# Altium project DDR4-UDIMM — 16 GB DDR4.PrjPcb (part 1 of 2)
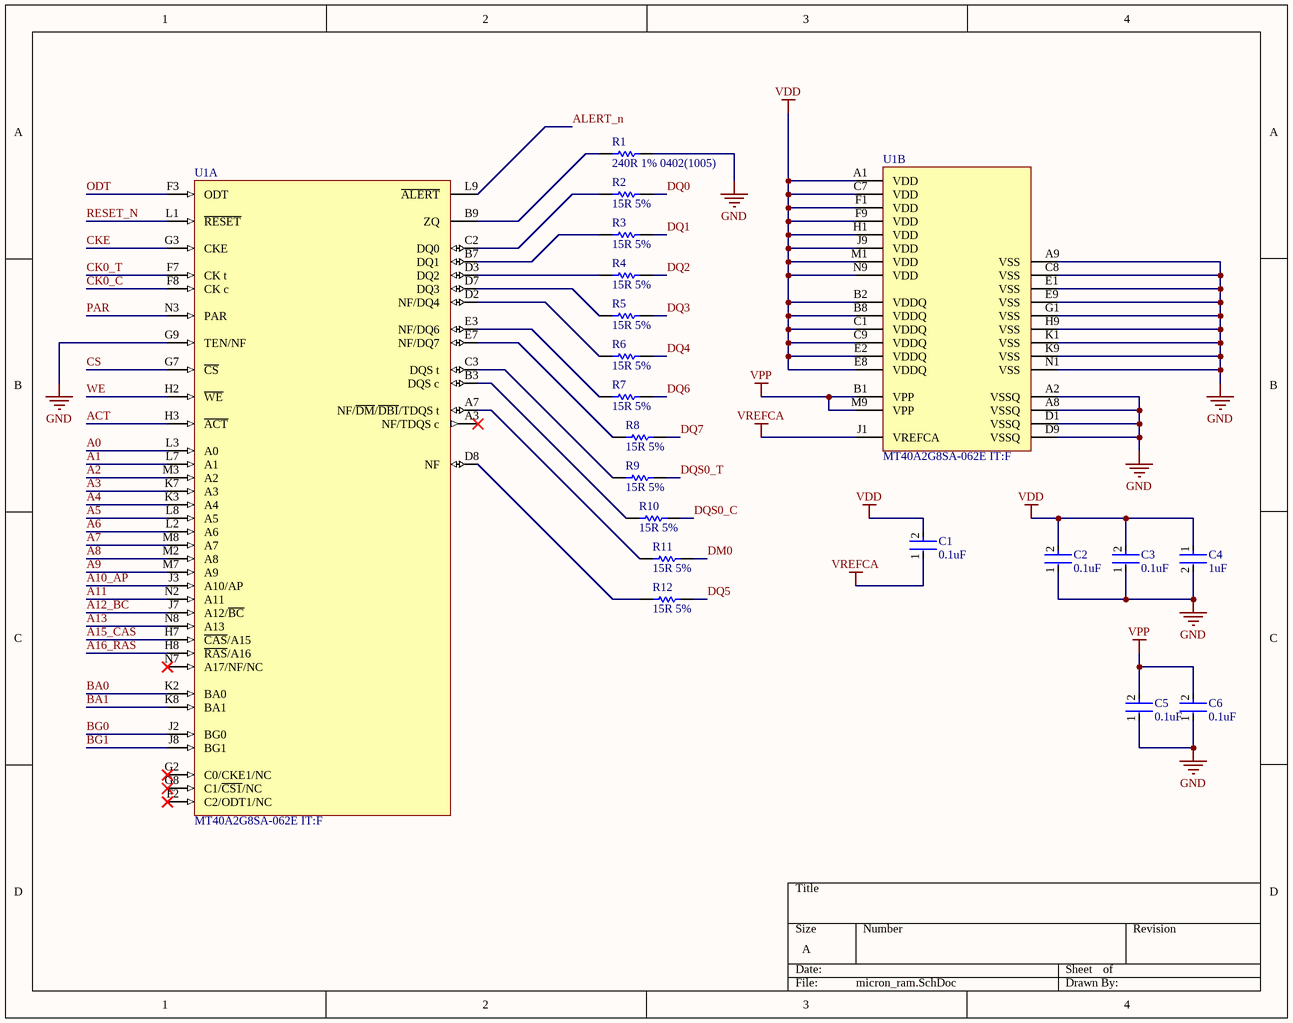
[diagram p0: micron_ram.SchDoc]
11 sheets, 206 parts. Net scope: global (net labels, ports and power ports of the same name join across sheets).
Board file: DDR4-UDIMM — 16 GB DDR4.PcbDoc
Sheets:
  micron_ram.SchDoc
  micron_P2.SchDoc
  micron_P3.SchDoc
  micron_P4.SchDoc
  micron_P5.SchDoc
  micron_P6.SchDoc
  micron_P7.SchDoc
  micron_P8.SchDoc
  edge.SchDoc
  SPD.SchDoc
  TERM.SchDoc

## Sheet micron_ram.SchDoc
size A; SheetNumber: 1; SheetTotal: 11

### Parts
C1  0.1uF  [FP-GRM15-MFG]
C2  0.1uF  [FP-GRM15-MFG]
C3  0.1uF  [FP-GRM15-MFG]
C4  1uF  [FP-CL511-IPC_C]
C5  0.1uF  [FP-GRM15-MFG]
C6  0.1uF  [FP-GRM15-MFG]
R1  240R 1% 0402(1005)  [RESC0402(1005)_L]
R2  15R 5%  [RESC1005X40X25LL05T10]
R3  15R 5%  [RESC1005X40X25LL05T10]
R4  15R 5%  [RESC1005X40X25LL05T10]
R5  15R 5%  [RESC1005X40X25LL05T10]
R6  15R 5%  [RESC1005X40X25LL05T10]
R7  15R 5%  [RESC1005X40X25LL05T10]
R8  15R 5%  [RESC1005X40X25LL05T10]
R9  15R 5%  [RESC1005X40X25LL05T10]
R10  15R 5%  [RESC1005X40X25LL05T10]
R11  15R 5%  [RESC1005X40X25LL05T10]
R12  15R 5%  [RESC1005X40X25LL05T10]
U1  MT40A2G8SA-062E IT:F  [SA_MFG]  (parts A,B of 2)

### Nets
GND: C2.1 C3.1 C4.2 C5.1 C6.1 R1.2 U1.A2(VSSQ) U1.A8(VSSQ) U1.A9(VSS) U1.C8(VSS) U1.D1(VSSQ) U1.D9(VSSQ) U1.E1(VSS) U1.E9(VSS) U1.G1(VSS) U1.G9(TEN/NF) U1.H9(VSS) U1.K1(VSS) U1.K9(VSS) U1.N1(VSS)
VDD: C1.2 C2.2 C3.2 C4.1 U1.A1(VDD) U1.B2(VDDQ) U1.B8(VDDQ) U1.C1(VDDQ) U1.C7(VDD) U1.C9(VDDQ) U1.E2(VDDQ) U1.E8(VDDQ) U1.F1(VDD) U1.F9(VDD) U1.H1(VDD) U1.J9(VDD) U1.M1(VDD) U1.N9(VDD)
VPP: C5.2 C6.2 U1.B1(VPP) U1.M9(VPP)
VREFCA: C1.1 U1.J1(VREFCA)
A0: U1.L3(A0)
A1: U1.L7(A1)
A2: U1.M3(A2)
A3: U1.K7(A3)
A4: U1.K3(A4)
A5: U1.L8(A5)
A6: U1.L2(A6)
A7: U1.M8(A7)
A8: U1.M2(A8)
A9: U1.M7(A9)
A10_AP: U1.J3(A10/AP)
A11: U1.N2(A11)
A12_BC: U1.J7(A12/~{BC})
A13: U1.N8(A13)
A15_CAS: U1.H7(~{CAS}/A15)
A16_RAS: U1.H8(~{RAS}/A16)
ACT: U1.H3(~{ACT})
ALERT_n: U1.L9(~{ALERT})
BA0: U1.K2(BA0)
BA1: U1.K8(BA1)
BG0: U1.J2(BG0)
BG1: U1.J8(BG1)
CK0_C: U1.F8(CK_c)
CK0_T: U1.F7(CK_t)
CKE: U1.G3(CKE)
CS: U1.G7(~{CS})
DM0: R11.2
DQ0: R2.2
DQ1: R3.2
DQ2: R4.2
DQ3: R5.2
DQ4: R6.2
DQ5: R12.2
DQ6: R7.2
DQ7: R8.2
DQS0_C: R10.2
DQS0_T: R9.2
ODT: U1.F3(ODT)
PAR: U1.N3(PAR)
RESET_N: U1.L1(~{RESET})
WE: U1.H2(~{WE})
NetR1_1: R1.1 U1.B9(ZQ)
NetR2_1: R2.1 U1.C2(DQ0)
NetR3_1: R3.1 U1.B7(DQ1)
NetR4_1: R4.1 U1.D3(DQ2)
NetR5_1: R5.1 U1.D7(DQ3)
NetR6_1: R6.1 U1.D2(NF/DQ4)
NetR7_1: R7.1 U1.E3(NF/DQ6)
NetR8_1: R8.1 U1.E7(NF/DQ7)
NetR9_1: R9.1 U1.C3(DQS_t)
NetR10_1: R10.1 U1.B3(DQS_c)
NetR11_1: R11.1 U1.A7(NF/~{DM}/~{DBI}/TDQS_t)
NetR12_1: R12.1 U1.D8(NF)

Not connected (* = marked no-connect by the designer): U1 A3(NF/TDQS_c)* F2(C2/ODT1/NC)* G2(C0/CKE1/NC)* G8(C1/~{CS1}/NC)* N7(A17/NF/NC)*

### Library data of the parts
C1-C3 C5 C6 = CMP-2100-03641-2: CAP CER 0.1UF 16V X7R 0402; Manufacturer Part Number: GRM155R71C104KA88D; Manufacturer: Murata; Standoff Height: 0mm; Tolerance: 10%; Voltage Rating: 16Vdc; Material: Ceramic; Capacitance: 0.10μF; Value: 0.10μF; RoHS: TRUE; Temperature Characteristic: X7R; Octopart: https://octopart.com/grm155r71c104ka88d-murata-196880; Digikey Description: CAP CER 0.1UF 16V X7R 0402; Device Class L3: Ceramic Capacitors; Height: 0.55mm; ComponentLink2Description: Datasheet; Temperature Range Low: -55°C; Ipc Land Pattern Name: CAPC10050X219; ComponentLink2URL: https://search.murata.co.jp/Ceramy/image/img/A01X/G101/ENG/GRM155R71H471KA01-01A.pdf; Device Class L1: Passive Components; Lead Free: yes; Category: Cap; Package: GRM15; Temperature: -55°C to +125°C; Device Class L2: Capacitors; Temperature Range High: +125°C; Mouser Description: 0402 0.1 uF 16V ±10 % Tolerance X7R SMT Multilayer Ceramic Capacitor
C4 = CMP-13271-001936-1: Cap Ceramic 1uF 10V X5R ±10% SMD 0402 +85°C Paper T/R; Depth: 0.5mm; Case Code (Imperial): 0402; Material: Ceramic; Mount: Surface Mount; Thickness: 0.022inch; Dielectric: X5R; Capacitance: 1uF; Radiation Hardening: No; Case/Package: 0402; Length: 1mm; Tolerance: 10%; Max Operating Temperature: 85°C; Package Quantity: 1; Width: 0.02inch; Voltage Rating: 10V; Contact Plating: Tin; Height: 0.5mm; Min Operating Temperature: -55°C; Case Code (Metric): 1005; Packaging: Tape and Reel
R1 = CMP-1011-00438-1: 240R 0.063W 1% 0402 (1005 Metric)  SMD; Case-Metric: 1005; Case-EIA: 0402; Value: 240.00 Ohm; Power: 0.063 W; Tolerance: 1 %; Technology: SMT
R2-R12 = CMP-2002-07413-1: Manufacturer: Yageo / Phycomp; Part Number: RC0402FR-0715RL
U1 = CMP-00526-125391410-1: DRAMChip DDR4 SDRAM 16Gbit 2Gx8 1.2V 78-Pin FBGA Tray; ComponentLink1URL: http://www.micron.com/; ComponentLink3Description: Manufacturer's Package Drawing; ComponentLink2Description: Datasheet URL; ComponentLink1Description: Manufacturer's Website; ComponentLink3URL: https://www.micron.com/content/dam/micron/global/public/products/customer-service-note/csn33-bga-user-guide.pdf; HelpURL: https://4donline.ihs.com/images/VipMasterIC/IC/MICT/MICT-S-A0014105731/MICT-S-A0014105731-1.pdf?hkey=6D3A4C79FDBF58556ACFDE234799DDF0; ComponentLink2URL: https://4donline.ihs.com/images/VipMasterIC/IC/MICT/MICT-S-A0014105731/MICT-S-A0014105731-1.pdf?hkey=6D3A4C79FDBF58556ACFDE234799DDF0

## Sheet micron_P2.SchDoc
size A; SheetNumber: 2; SheetTotal: 11
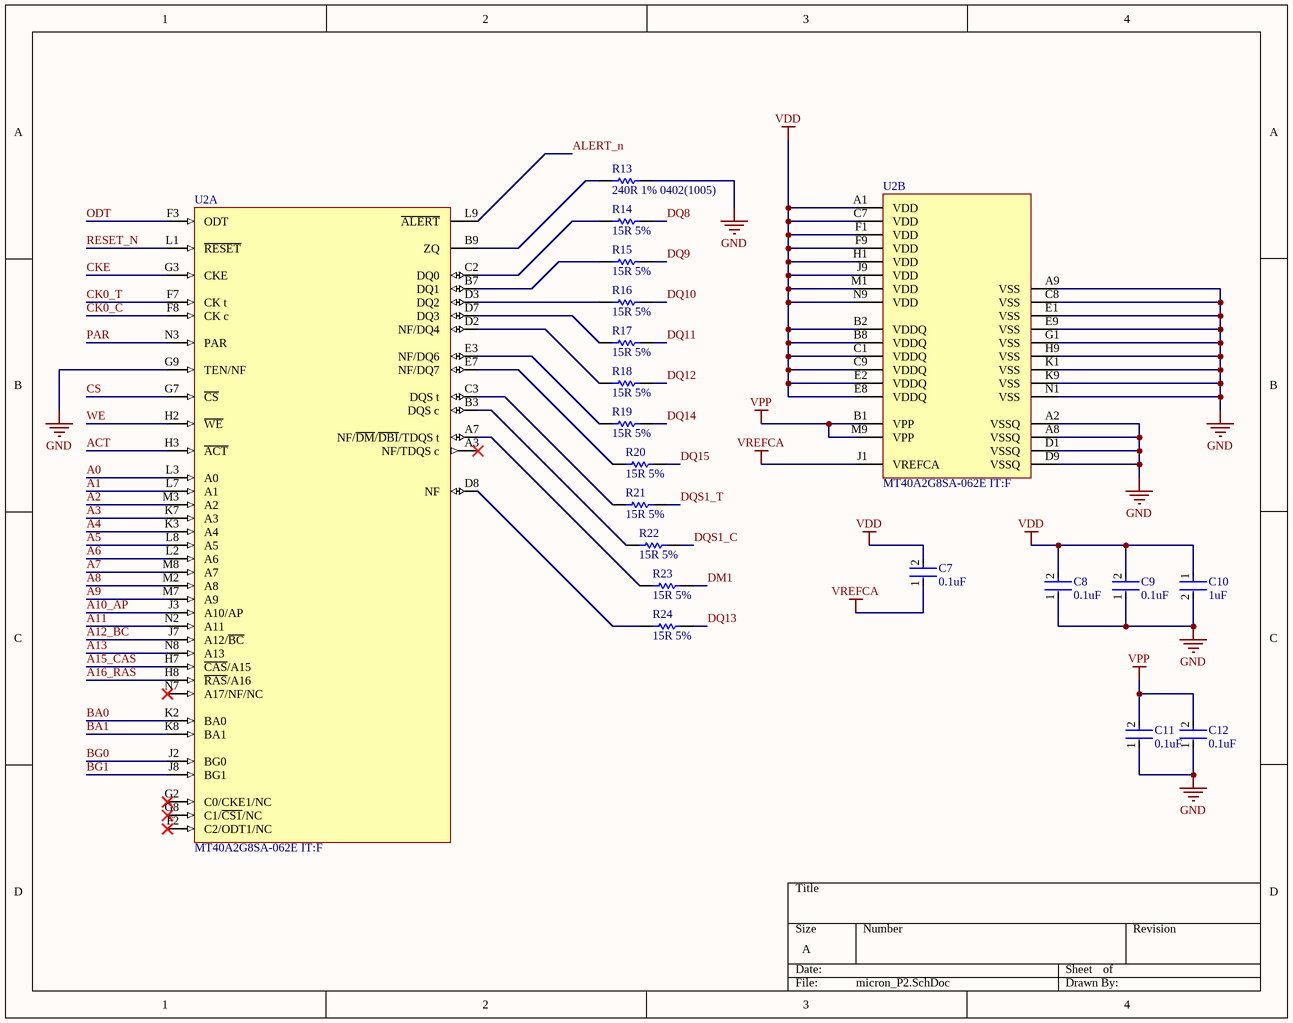
[diagram p1: micron_P2.SchDoc]

### Parts
C7  0.1uF  [FP-GRM15-MFG]
C8  0.1uF  [FP-GRM15-MFG]
C9  0.1uF  [FP-GRM15-MFG]
C10  1uF  [FP-CL511-IPC_C]
C11  0.1uF  [FP-GRM15-MFG]
C12  0.1uF  [FP-GRM15-MFG]
R13  240R 1% 0402(1005)  [RESC0402(1005)_L]
R14  15R 5%  [RESC1005X40X25LL05T10]
R15  15R 5%  [RESC1005X40X25LL05T10]
R16  15R 5%  [RESC1005X40X25LL05T10]
R17  15R 5%  [RESC1005X40X25LL05T10]
R18  15R 5%  [RESC1005X40X25LL05T10]
R19  15R 5%  [RESC1005X40X25LL05T10]
R20  15R 5%  [RESC1005X40X25LL05T10]
R21  15R 5%  [RESC1005X40X25LL05T10]
R22  15R 5%  [RESC1005X40X25LL05T10]
R23  15R 5%  [RESC1005X40X25LL05T10]
R24  15R 5%  [RESC1005X40X25LL05T10]
U2  MT40A2G8SA-062E IT:F  [SA_MFG]  (parts A,B of 2)

### Nets
GND: C8.1 C9.1 C10.2 C11.1 C12.1 R13.2 U2.A2(VSSQ) U2.A8(VSSQ) U2.A9(VSS) U2.C8(VSS) U2.D1(VSSQ) U2.D9(VSSQ) U2.E1(VSS) U2.E9(VSS) U2.G1(VSS) U2.G9(TEN/NF) U2.H9(VSS) U2.K1(VSS) U2.K9(VSS) U2.N1(VSS)
VDD: C7.2 C8.2 C9.2 C10.1 U2.A1(VDD) U2.B2(VDDQ) U2.B8(VDDQ) U2.C1(VDDQ) U2.C7(VDD) U2.C9(VDDQ) U2.E2(VDDQ) U2.E8(VDDQ) U2.F1(VDD) U2.F9(VDD) U2.H1(VDD) U2.J9(VDD) U2.M1(VDD) U2.N9(VDD)
VPP: C11.2 C12.2 U2.B1(VPP) U2.M9(VPP)
VREFCA: C7.1 U2.J1(VREFCA)
A0: U2.L3(A0)
A1: U2.L7(A1)
A2: U2.M3(A2)
A3: U2.K7(A3)
A4: U2.K3(A4)
A5: U2.L8(A5)
A6: U2.L2(A6)
A7: U2.M8(A7)
A8: U2.M2(A8)
A9: U2.M7(A9)
A10_AP: U2.J3(A10/AP)
A11: U2.N2(A11)
A12_BC: U2.J7(A12/~{BC})
A13: U2.N8(A13)
A15_CAS: U2.H7(~{CAS}/A15)
A16_RAS: U2.H8(~{RAS}/A16)
ACT: U2.H3(~{ACT})
ALERT_n: U2.L9(~{ALERT})
BA0: U2.K2(BA0)
BA1: U2.K8(BA1)
BG0: U2.J2(BG0)
BG1: U2.J8(BG1)
CK0_C: U2.F8(CK_c)
CK0_T: U2.F7(CK_t)
CKE: U2.G3(CKE)
CS: U2.G7(~{CS})
DM1: R23.2
DQ8: R14.2
DQ9: R15.2
DQ10: R16.2
DQ11: R17.2
DQ12: R18.2
DQ13: R24.2
DQ14: R19.2
DQ15: R20.2
DQS1_C: R22.2
DQS1_T: R21.2
ODT: U2.F3(ODT)
PAR: U2.N3(PAR)
RESET_N: U2.L1(~{RESET})
WE: U2.H2(~{WE})
NetR13_1: R13.1 U2.B9(ZQ)
NetR14_1: R14.1 U2.C2(DQ0)
NetR15_1: R15.1 U2.B7(DQ1)
NetR16_1: R16.1 U2.D3(DQ2)
NetR17_1: R17.1 U2.D7(DQ3)
NetR18_1: R18.1 U2.D2(NF/DQ4)
NetR19_1: R19.1 U2.E3(NF/DQ6)
NetR20_1: R20.1 U2.E7(NF/DQ7)
NetR21_1: R21.1 U2.C3(DQS_t)
NetR22_1: R22.1 U2.B3(DQS_c)
NetR23_1: R23.1 U2.A7(NF/~{DM}/~{DBI}/TDQS_t)
NetR24_1: R24.1 U2.D8(NF)

Not connected (* = marked no-connect by the designer): U2 A3(NF/TDQS_c)* F2(C2/ODT1/NC)* G2(C0/CKE1/NC)* G8(C1/~{CS1}/NC)* N7(A17/NF/NC)*

### Library data of the parts
C7-C9 C11 C12 = CMP-2100-03641-2: as C1 on sheet micron_ram; RoHS: TRUE; Temperature Characteristic: X7R; Octopart: https://octopart.com/grm155r71c104ka88d-murata-196880; Digikey Description: CAP CER 0.1UF 16V X7R 0402; Device Class L3: Ceramic Capacitors; Height: 0.55mm; ComponentLink2Description: Datasheet; Temperature Range Low: -55°C; Ipc Land Pattern Name: CAPC10050X219; ComponentLink2URL: https://search.murata.co.jp/Ceramy/image/img/A01X/G101/ENG/GRM155R71H471KA01-01A.pdf; Device Class L1: Passive Components; Lead Free: yes; Category: Cap; Package: GRM15; Temperature: -55°C to +125°C; Device Class L2: Capacitors; Temperature Range High: +125°C; Mouser Description: 0402 0.1 uF 16V ±10 % Tolerance X7R SMT Multilayer Ceramic Capacitor
C10 = CMP-13271-001936-1: as C4 on sheet micron_ram; Depth: 0.5mm; Case Code (Imperial): 0402; Material: Ceramic; Mount: Surface Mount; Thickness: 0.022inch; Dielectric: X5R; Capacitance: 1uF; Radiation Hardening: No; Case/Package: 0402; Length: 1mm; Tolerance: 10%; Max Operating Temperature: 85°C; Package Quantity: 1; Width: 0.02inch; Voltage Rating: 10V; Contact Plating: Tin; Height: 0.5mm; Min Operating Temperature: -55°C; Case Code (Metric): 1005; Packaging: Tape and Reel
R13 = CMP-1011-00438-1: as R1 on sheet micron_ram; Power: 0.063 W; Tolerance: 1 %; Technology: SMT
R14-R24 = CMP-2002-07413-1: as R2 on sheet micron_ram
U2 = CMP-00526-125391410-1: as U1 on sheet micron_ram; ComponentLink1URL: http://www.micron.com/; ComponentLink3Description: Manufacturer's Package Drawing; ComponentLink2Description: Datasheet URL; ComponentLink1Description: Manufacturer's Website; ComponentLink3URL: https://www.micron.com/content/dam/micron/global/public/products/customer-service-note/csn33-bga-user-guide.pdf; HelpURL: https://4donline.ihs.com/images/VipMasterIC/IC/MICT/MICT-S-A0014105731/MICT-S-A0014105731-1.pdf?hkey=6D3A4C79FDBF58556ACFDE234799DDF0; ComponentLink2URL: https://4donline.ihs.com/images/VipMasterIC/IC/MICT/MICT-S-A0014105731/MICT-S-A0014105731-1.pdf?hkey=6D3A4C79FDBF58556ACFDE234799DDF0

## Sheet micron_P3.SchDoc
size A; SheetNumber: 3; SheetTotal: 11
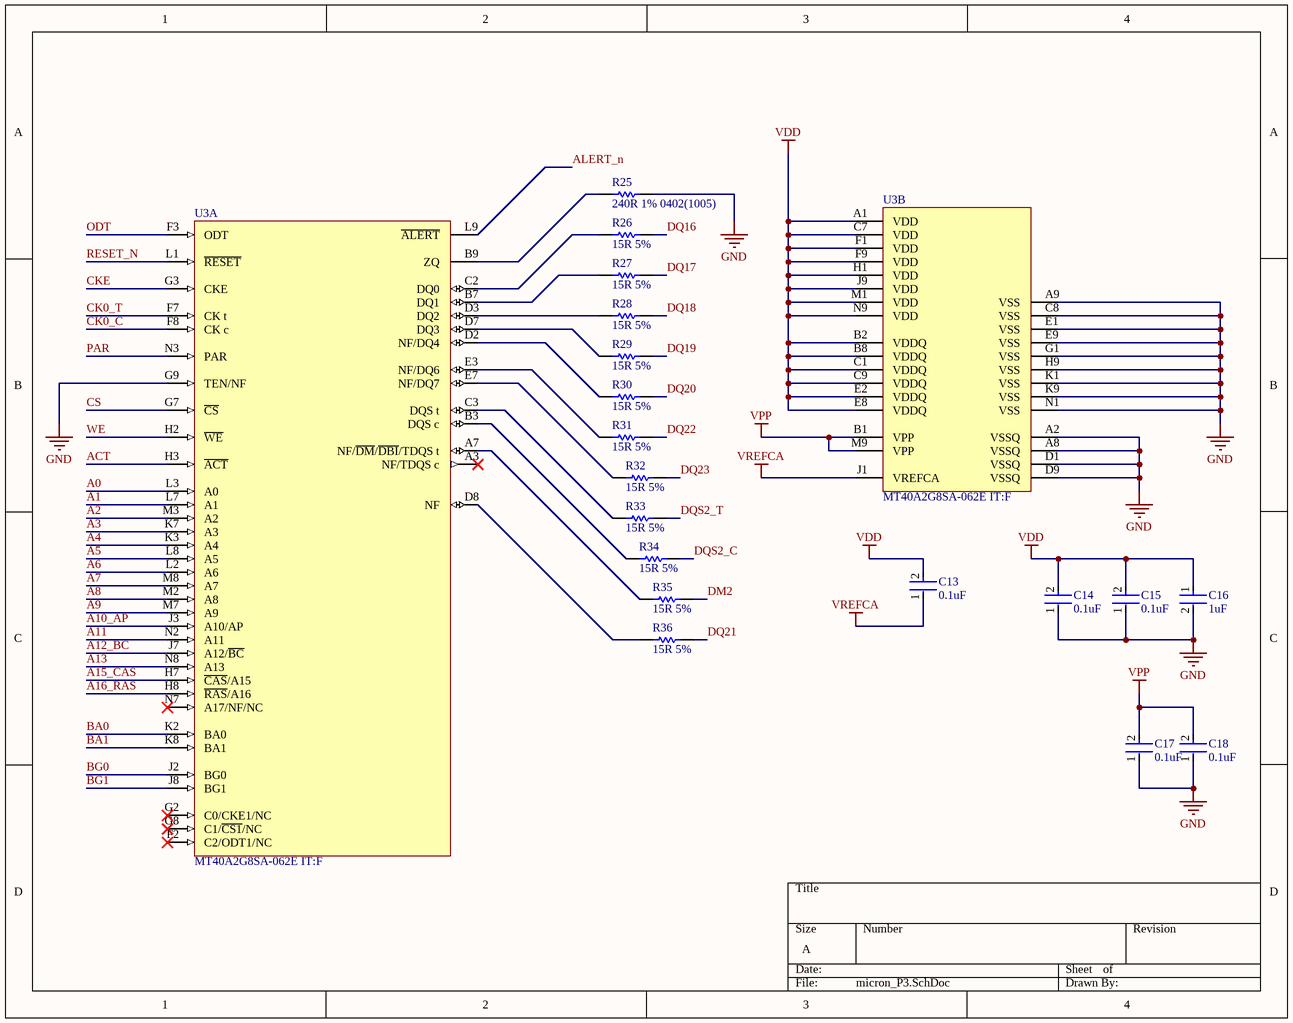
[diagram p2: micron_P3.SchDoc]

### Parts
C13  0.1uF  [FP-GRM15-MFG]
C14  0.1uF  [FP-GRM15-MFG]
C15  0.1uF  [FP-GRM15-MFG]
C16  1uF  [FP-CL511-IPC_C]
C17  0.1uF  [FP-GRM15-MFG]
C18  0.1uF  [FP-GRM15-MFG]
R25  240R 1% 0402(1005)  [RESC0402(1005)_L]
R26  15R 5%  [RESC1005X40X25LL05T10]
R27  15R 5%  [RESC1005X40X25LL05T10]
R28  15R 5%  [RESC1005X40X25LL05T10]
R29  15R 5%  [RESC1005X40X25LL05T10]
R30  15R 5%  [RESC1005X40X25LL05T10]
R31  15R 5%  [RESC1005X40X25LL05T10]
R32  15R 5%  [RESC1005X40X25LL05T10]
R33  15R 5%  [RESC1005X40X25LL05T10]
R34  15R 5%  [RESC1005X40X25LL05T10]
R35  15R 5%  [RESC1005X40X25LL05T10]
R36  15R 5%  [RESC1005X40X25LL05T10]
U3  MT40A2G8SA-062E IT:F  [SA_MFG]  (parts A,B of 2)

### Nets
GND: C14.1 C15.1 C16.2 C17.1 C18.1 R25.2 U3.A2(VSSQ) U3.A8(VSSQ) U3.A9(VSS) U3.C8(VSS) U3.D1(VSSQ) U3.D9(VSSQ) U3.E1(VSS) U3.E9(VSS) U3.G1(VSS) U3.G9(TEN/NF) U3.H9(VSS) U3.K1(VSS) U3.K9(VSS) U3.N1(VSS)
VDD: C13.2 C14.2 C15.2 C16.1 U3.A1(VDD) U3.B2(VDDQ) U3.B8(VDDQ) U3.C1(VDDQ) U3.C7(VDD) U3.C9(VDDQ) U3.E2(VDDQ) U3.E8(VDDQ) U3.F1(VDD) U3.F9(VDD) U3.H1(VDD) U3.J9(VDD) U3.M1(VDD) U3.N9(VDD)
VPP: C17.2 C18.2 U3.B1(VPP) U3.M9(VPP)
VREFCA: C13.1 U3.J1(VREFCA)
A0: U3.L3(A0)
A1: U3.L7(A1)
A2: U3.M3(A2)
A3: U3.K7(A3)
A4: U3.K3(A4)
A5: U3.L8(A5)
A6: U3.L2(A6)
A7: U3.M8(A7)
A8: U3.M2(A8)
A9: U3.M7(A9)
A10_AP: U3.J3(A10/AP)
A11: U3.N2(A11)
A12_BC: U3.J7(A12/~{BC})
A13: U3.N8(A13)
A15_CAS: U3.H7(~{CAS}/A15)
A16_RAS: U3.H8(~{RAS}/A16)
ACT: U3.H3(~{ACT})
ALERT_n: U3.L9(~{ALERT})
BA0: U3.K2(BA0)
BA1: U3.K8(BA1)
BG0: U3.J2(BG0)
BG1: U3.J8(BG1)
CK0_C: U3.F8(CK_c)
CK0_T: U3.F7(CK_t)
CKE: U3.G3(CKE)
CS: U3.G7(~{CS})
DM2: R35.2
DQ16: R26.2
DQ17: R27.2
DQ18: R28.2
DQ19: R29.2
DQ20: R30.2
DQ21: R36.2
DQ22: R31.2
DQ23: R32.2
DQS2_C: R34.2
DQS2_T: R33.2
ODT: U3.F3(ODT)
PAR: U3.N3(PAR)
RESET_N: U3.L1(~{RESET})
WE: U3.H2(~{WE})
NetR25_1: R25.1 U3.B9(ZQ)
NetR26_1: R26.1 U3.C2(DQ0)
NetR27_1: R27.1 U3.B7(DQ1)
NetR28_1: R28.1 U3.D3(DQ2)
NetR29_1: R29.1 U3.D7(DQ3)
NetR30_1: R30.1 U3.D2(NF/DQ4)
NetR31_1: R31.1 U3.E3(NF/DQ6)
NetR32_1: R32.1 U3.E7(NF/DQ7)
NetR33_1: R33.1 U3.C3(DQS_t)
NetR34_1: R34.1 U3.B3(DQS_c)
NetR35_1: R35.1 U3.A7(NF/~{DM}/~{DBI}/TDQS_t)
NetR36_1: R36.1 U3.D8(NF)

Not connected (* = marked no-connect by the designer): U3 A3(NF/TDQS_c)* F2(C2/ODT1/NC)* G2(C0/CKE1/NC)* G8(C1/~{CS1}/NC)* N7(A17/NF/NC)*

### Library data of the parts
C13-C15 C17 C18 = CMP-2100-03641-2: as C1 on sheet micron_ram; RoHS: TRUE; Temperature Characteristic: X7R; Octopart: https://octopart.com/grm155r71c104ka88d-murata-196880; Digikey Description: CAP CER 0.1UF 16V X7R 0402; Device Class L3: Ceramic Capacitors; Height: 0.55mm; ComponentLink2Description: Datasheet; Temperature Range Low: -55°C; Ipc Land Pattern Name: CAPC10050X219; ComponentLink2URL: https://search.murata.co.jp/Ceramy/image/img/A01X/G101/ENG/GRM155R71H471KA01-01A.pdf; Device Class L1: Passive Components; Lead Free: yes; Category: Cap; Package: GRM15; Temperature: -55°C to +125°C; Device Class L2: Capacitors; Temperature Range High: +125°C; Mouser Description: 0402 0.1 uF 16V ±10 % Tolerance X7R SMT Multilayer Ceramic Capacitor
C16 = CMP-13271-001936-1: as C4 on sheet micron_ram; Depth: 0.5mm; Case Code (Imperial): 0402; Material: Ceramic; Mount: Surface Mount; Thickness: 0.022inch; Dielectric: X5R; Capacitance: 1uF; Radiation Hardening: No; Case/Package: 0402; Length: 1mm; Tolerance: 10%; Max Operating Temperature: 85°C; Package Quantity: 1; Width: 0.02inch; Voltage Rating: 10V; Contact Plating: Tin; Height: 0.5mm; Min Operating Temperature: -55°C; Case Code (Metric): 1005; Packaging: Tape and Reel
R25 = CMP-1011-00438-1: as R1 on sheet micron_ram; Power: 0.063 W; Tolerance: 1 %; Technology: SMT
R26-R36 = CMP-2002-07413-1: as R2 on sheet micron_ram
U3 = CMP-00526-125391410-1: as U1 on sheet micron_ram; ComponentLink1URL: http://www.micron.com/; ComponentLink3Description: Manufacturer's Package Drawing; ComponentLink2Description: Datasheet URL; ComponentLink1Description: Manufacturer's Website; ComponentLink3URL: https://www.micron.com/content/dam/micron/global/public/products/customer-service-note/csn33-bga-user-guide.pdf; HelpURL: https://4donline.ihs.com/images/VipMasterIC/IC/MICT/MICT-S-A0014105731/MICT-S-A0014105731-1.pdf?hkey=6D3A4C79FDBF58556ACFDE234799DDF0; ComponentLink2URL: https://4donline.ihs.com/images/VipMasterIC/IC/MICT/MICT-S-A0014105731/MICT-S-A0014105731-1.pdf?hkey=6D3A4C79FDBF58556ACFDE234799DDF0

## Sheet micron_P4.SchDoc
size A; SheetNumber: 4; SheetTotal: 11
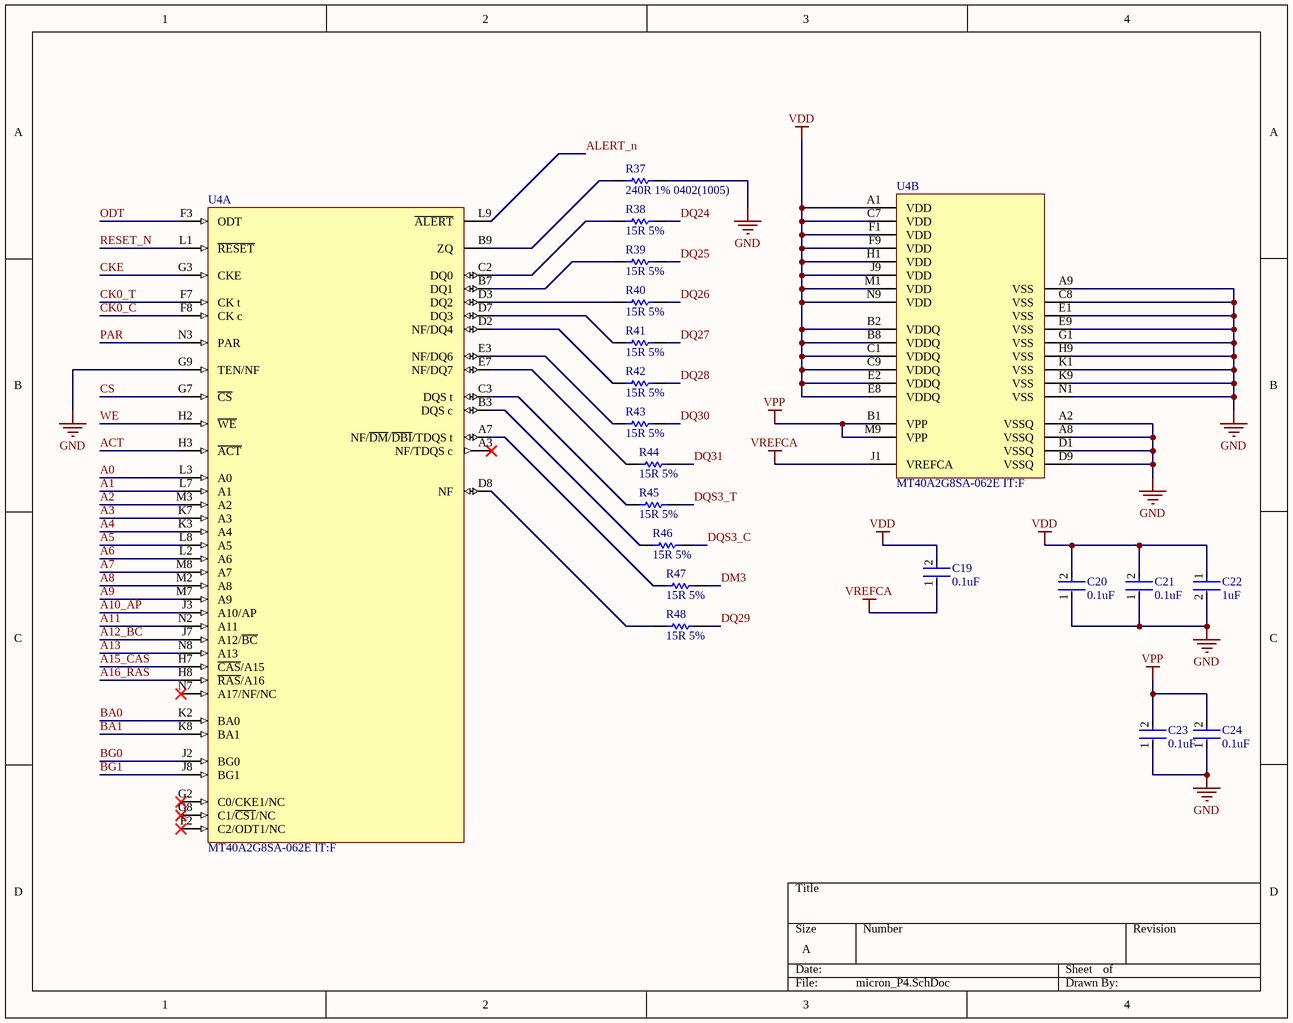
[diagram p3: micron_P4.SchDoc]

### Parts
C19  0.1uF  [FP-GRM15-MFG]
C20  0.1uF  [FP-GRM15-MFG]
C21  0.1uF  [FP-GRM15-MFG]
C22  1uF  [FP-CL511-IPC_C]
C23  0.1uF  [FP-GRM15-MFG]
C24  0.1uF  [FP-GRM15-MFG]
R37  240R 1% 0402(1005)  [RESC0402(1005)_L]
R38  15R 5%  [RESC1005X40X25LL05T10]
R39  15R 5%  [RESC1005X40X25LL05T10]
R40  15R 5%  [RESC1005X40X25LL05T10]
R41  15R 5%  [RESC1005X40X25LL05T10]
R42  15R 5%  [RESC1005X40X25LL05T10]
R43  15R 5%  [RESC1005X40X25LL05T10]
R44  15R 5%  [RESC1005X40X25LL05T10]
R45  15R 5%  [RESC1005X40X25LL05T10]
R46  15R 5%  [RESC1005X40X25LL05T10]
R47  15R 5%  [RESC1005X40X25LL05T10]
R48  15R 5%  [RESC1005X40X25LL05T10]
U4  MT40A2G8SA-062E IT:F  [SA_MFG]  (parts A,B of 2)

### Nets
GND: C20.1 C21.1 C22.2 C23.1 C24.1 R37.2 U4.A2(VSSQ) U4.A8(VSSQ) U4.A9(VSS) U4.C8(VSS) U4.D1(VSSQ) U4.D9(VSSQ) U4.E1(VSS) U4.E9(VSS) U4.G1(VSS) U4.G9(TEN/NF) U4.H9(VSS) U4.K1(VSS) U4.K9(VSS) U4.N1(VSS)
VDD: C19.2 C20.2 C21.2 C22.1 U4.A1(VDD) U4.B2(VDDQ) U4.B8(VDDQ) U4.C1(VDDQ) U4.C7(VDD) U4.C9(VDDQ) U4.E2(VDDQ) U4.E8(VDDQ) U4.F1(VDD) U4.F9(VDD) U4.H1(VDD) U4.J9(VDD) U4.M1(VDD) U4.N9(VDD)
VPP: C23.2 C24.2 U4.B1(VPP) U4.M9(VPP)
VREFCA: C19.1 U4.J1(VREFCA)
A0: U4.L3(A0)
A1: U4.L7(A1)
A2: U4.M3(A2)
A3: U4.K7(A3)
A4: U4.K3(A4)
A5: U4.L8(A5)
A6: U4.L2(A6)
A7: U4.M8(A7)
A8: U4.M2(A8)
A9: U4.M7(A9)
A10_AP: U4.J3(A10/AP)
A11: U4.N2(A11)
A12_BC: U4.J7(A12/~{BC})
A13: U4.N8(A13)
A15_CAS: U4.H7(~{CAS}/A15)
A16_RAS: U4.H8(~{RAS}/A16)
ACT: U4.H3(~{ACT})
ALERT_n: U4.L9(~{ALERT})
BA0: U4.K2(BA0)
BA1: U4.K8(BA1)
BG0: U4.J2(BG0)
BG1: U4.J8(BG1)
CK0_C: U4.F8(CK_c)
CK0_T: U4.F7(CK_t)
CKE: U4.G3(CKE)
CS: U4.G7(~{CS})
DM3: R47.2
DQ24: R38.2
DQ25: R39.2
DQ26: R40.2
DQ27: R41.2
DQ28: R42.2
DQ29: R48.2
DQ30: R43.2
DQ31: R44.2
DQS3_C: R46.2
DQS3_T: R45.2
ODT: U4.F3(ODT)
PAR: U4.N3(PAR)
RESET_N: U4.L1(~{RESET})
WE: U4.H2(~{WE})
NetR37_1: R37.1 U4.B9(ZQ)
NetR38_1: R38.1 U4.C2(DQ0)
NetR39_1: R39.1 U4.B7(DQ1)
NetR40_1: R40.1 U4.D3(DQ2)
NetR41_1: R41.1 U4.D7(DQ3)
NetR42_1: R42.1 U4.D2(NF/DQ4)
NetR43_1: R43.1 U4.E3(NF/DQ6)
NetR44_1: R44.1 U4.E7(NF/DQ7)
NetR45_1: R45.1 U4.C3(DQS_t)
NetR46_1: R46.1 U4.B3(DQS_c)
NetR47_1: R47.1 U4.A7(NF/~{DM}/~{DBI}/TDQS_t)
NetR48_1: R48.1 U4.D8(NF)

Not connected (* = marked no-connect by the designer): U4 A3(NF/TDQS_c)* F2(C2/ODT1/NC)* G2(C0/CKE1/NC)* G8(C1/~{CS1}/NC)* N7(A17/NF/NC)*

### Library data of the parts
C19-C21 C23 C24 = CMP-2100-03641-2: as C1 on sheet micron_ram; RoHS: TRUE; Temperature Characteristic: X7R; Octopart: https://octopart.com/grm155r71c104ka88d-murata-196880; Digikey Description: CAP CER 0.1UF 16V X7R 0402; Device Class L3: Ceramic Capacitors; Height: 0.55mm; ComponentLink2Description: Datasheet; Temperature Range Low: -55°C; Ipc Land Pattern Name: CAPC10050X219; ComponentLink2URL: https://search.murata.co.jp/Ceramy/image/img/A01X/G101/ENG/GRM155R71H471KA01-01A.pdf; Device Class L1: Passive Components; Lead Free: yes; Category: Cap; Package: GRM15; Temperature: -55°C to +125°C; Device Class L2: Capacitors; Temperature Range High: +125°C; Mouser Description: 0402 0.1 uF 16V ±10 % Tolerance X7R SMT Multilayer Ceramic Capacitor
C22 = CMP-13271-001936-1: as C4 on sheet micron_ram; Depth: 0.5mm; Case Code (Imperial): 0402; Material: Ceramic; Mount: Surface Mount; Thickness: 0.022inch; Dielectric: X5R; Capacitance: 1uF; Radiation Hardening: No; Case/Package: 0402; Length: 1mm; Tolerance: 10%; Max Operating Temperature: 85°C; Package Quantity: 1; Width: 0.02inch; Voltage Rating: 10V; Contact Plating: Tin; Height: 0.5mm; Min Operating Temperature: -55°C; Case Code (Metric): 1005; Packaging: Tape and Reel
R37 = CMP-1011-00438-1: as R1 on sheet micron_ram; Power: 0.063 W; Tolerance: 1 %; Technology: SMT
R38-R48 = CMP-2002-07413-1: as R2 on sheet micron_ram
U4 = CMP-00526-125391410-1: as U1 on sheet micron_ram; ComponentLink1URL: http://www.micron.com/; ComponentLink3Description: Manufacturer's Package Drawing; ComponentLink2Description: Datasheet URL; ComponentLink1Description: Manufacturer's Website; ComponentLink3URL: https://www.micron.com/content/dam/micron/global/public/products/customer-service-note/csn33-bga-user-guide.pdf; HelpURL: https://4donline.ihs.com/images/VipMasterIC/IC/MICT/MICT-S-A0014105731/MICT-S-A0014105731-1.pdf?hkey=6D3A4C79FDBF58556ACFDE234799DDF0; ComponentLink2URL: https://4donline.ihs.com/images/VipMasterIC/IC/MICT/MICT-S-A0014105731/MICT-S-A0014105731-1.pdf?hkey=6D3A4C79FDBF58556ACFDE234799DDF0

## Sheet micron_P5.SchDoc
size A; SheetNumber: 5; SheetTotal: 11
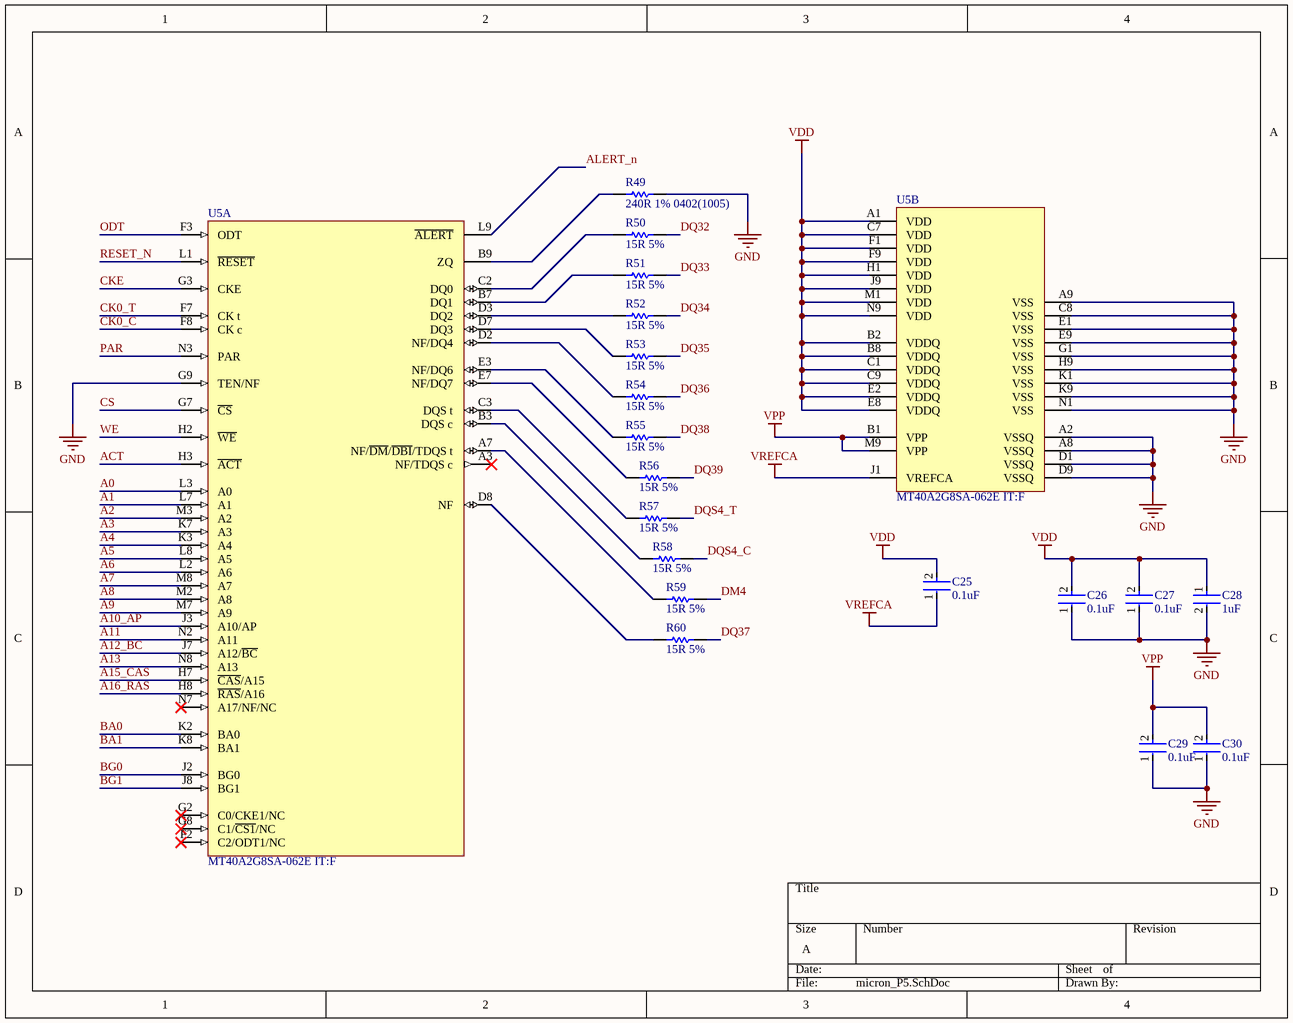
[diagram p4: micron_P5.SchDoc]

### Parts
C25  0.1uF  [FP-GRM15-MFG]
C26  0.1uF  [FP-GRM15-MFG]
C27  0.1uF  [FP-GRM15-MFG]
C28  1uF  [FP-CL511-IPC_C]
C29  0.1uF  [FP-GRM15-MFG]
C30  0.1uF  [FP-GRM15-MFG]
R49  240R 1% 0402(1005)  [RESC0402(1005)_L]
R50  15R 5%  [RESC1005X40X25LL05T10]
R51  15R 5%  [RESC1005X40X25LL05T10]
R52  15R 5%  [RESC1005X40X25LL05T10]
R53  15R 5%  [RESC1005X40X25LL05T10]
R54  15R 5%  [RESC1005X40X25LL05T10]
R55  15R 5%  [RESC1005X40X25LL05T10]
R56  15R 5%  [RESC1005X40X25LL05T10]
R57  15R 5%  [RESC1005X40X25LL05T10]
R58  15R 5%  [RESC1005X40X25LL05T10]
R59  15R 5%  [RESC1005X40X25LL05T10]
R60  15R 5%  [RESC1005X40X25LL05T10]
U5  MT40A2G8SA-062E IT:F  [SA_MFG]  (parts A,B of 2)

### Nets
GND: C26.1 C27.1 C28.2 C29.1 C30.1 R49.2 U5.A2(VSSQ) U5.A8(VSSQ) U5.A9(VSS) U5.C8(VSS) U5.D1(VSSQ) U5.D9(VSSQ) U5.E1(VSS) U5.E9(VSS) U5.G1(VSS) U5.G9(TEN/NF) U5.H9(VSS) U5.K1(VSS) U5.K9(VSS) U5.N1(VSS)
VDD: C25.2 C26.2 C27.2 C28.1 U5.A1(VDD) U5.B2(VDDQ) U5.B8(VDDQ) U5.C1(VDDQ) U5.C7(VDD) U5.C9(VDDQ) U5.E2(VDDQ) U5.E8(VDDQ) U5.F1(VDD) U5.F9(VDD) U5.H1(VDD) U5.J9(VDD) U5.M1(VDD) U5.N9(VDD)
VPP: C29.2 C30.2 U5.B1(VPP) U5.M9(VPP)
VREFCA: C25.1 U5.J1(VREFCA)
A0: U5.L3(A0)
A1: U5.L7(A1)
A2: U5.M3(A2)
A3: U5.K7(A3)
A4: U5.K3(A4)
A5: U5.L8(A5)
A6: U5.L2(A6)
A7: U5.M8(A7)
A8: U5.M2(A8)
A9: U5.M7(A9)
A10_AP: U5.J3(A10/AP)
A11: U5.N2(A11)
A12_BC: U5.J7(A12/~{BC})
A13: U5.N8(A13)
A15_CAS: U5.H7(~{CAS}/A15)
A16_RAS: U5.H8(~{RAS}/A16)
ACT: U5.H3(~{ACT})
ALERT_n: U5.L9(~{ALERT})
BA0: U5.K2(BA0)
BA1: U5.K8(BA1)
BG0: U5.J2(BG0)
BG1: U5.J8(BG1)
CK0_C: U5.F8(CK_c)
CK0_T: U5.F7(CK_t)
CKE: U5.G3(CKE)
CS: U5.G7(~{CS})
DM4: R59.2
DQ32: R50.2
DQ33: R51.2
DQ34: R52.2
DQ35: R53.2
DQ36: R54.2
DQ37: R60.2
DQ38: R55.2
DQ39: R56.2
DQS4_C: R58.2
DQS4_T: R57.2
ODT: U5.F3(ODT)
PAR: U5.N3(PAR)
RESET_N: U5.L1(~{RESET})
WE: U5.H2(~{WE})
NetR49_1: R49.1 U5.B9(ZQ)
NetR50_1: R50.1 U5.C2(DQ0)
NetR51_1: R51.1 U5.B7(DQ1)
NetR52_1: R52.1 U5.D3(DQ2)
NetR53_1: R53.1 U5.D7(DQ3)
NetR54_1: R54.1 U5.D2(NF/DQ4)
NetR55_1: R55.1 U5.E3(NF/DQ6)
NetR56_1: R56.1 U5.E7(NF/DQ7)
NetR57_1: R57.1 U5.C3(DQS_t)
NetR58_1: R58.1 U5.B3(DQS_c)
NetR59_1: R59.1 U5.A7(NF/~{DM}/~{DBI}/TDQS_t)
NetR60_1: R60.1 U5.D8(NF)

Not connected (* = marked no-connect by the designer): U5 A3(NF/TDQS_c)* F2(C2/ODT1/NC)* G2(C0/CKE1/NC)* G8(C1/~{CS1}/NC)* N7(A17/NF/NC)*

### Library data of the parts
C25-C27 C29 C30 = CMP-2100-03641-2: as C1 on sheet micron_ram; RoHS: TRUE; Temperature Characteristic: X7R; Octopart: https://octopart.com/grm155r71c104ka88d-murata-196880; Digikey Description: CAP CER 0.1UF 16V X7R 0402; Device Class L3: Ceramic Capacitors; Height: 0.55mm; ComponentLink2Description: Datasheet; Temperature Range Low: -55°C; Ipc Land Pattern Name: CAPC10050X219; ComponentLink2URL: https://search.murata.co.jp/Ceramy/image/img/A01X/G101/ENG/GRM155R71H471KA01-01A.pdf; Device Class L1: Passive Components; Lead Free: yes; Category: Cap; Package: GRM15; Temperature: -55°C to +125°C; Device Class L2: Capacitors; Temperature Range High: +125°C; Mouser Description: 0402 0.1 uF 16V ±10 % Tolerance X7R SMT Multilayer Ceramic Capacitor
C28 = CMP-13271-001936-1: as C4 on sheet micron_ram; Depth: 0.5mm; Case Code (Imperial): 0402; Material: Ceramic; Mount: Surface Mount; Thickness: 0.022inch; Dielectric: X5R; Capacitance: 1uF; Radiation Hardening: No; Case/Package: 0402; Length: 1mm; Tolerance: 10%; Max Operating Temperature: 85°C; Package Quantity: 1; Width: 0.02inch; Voltage Rating: 10V; Contact Plating: Tin; Height: 0.5mm; Min Operating Temperature: -55°C; Case Code (Metric): 1005; Packaging: Tape and Reel
R49 = CMP-1011-00438-1: as R1 on sheet micron_ram; Power: 0.063 W; Tolerance: 1 %; Technology: SMT
R50-R60 = CMP-2002-07413-1: as R2 on sheet micron_ram
U5 = CMP-00526-125391410-1: as U1 on sheet micron_ram; ComponentLink1URL: http://www.micron.com/; ComponentLink3Description: Manufacturer's Package Drawing; ComponentLink2Description: Datasheet URL; ComponentLink1Description: Manufacturer's Website; ComponentLink3URL: https://www.micron.com/content/dam/micron/global/public/products/customer-service-note/csn33-bga-user-guide.pdf; HelpURL: https://4donline.ihs.com/images/VipMasterIC/IC/MICT/MICT-S-A0014105731/MICT-S-A0014105731-1.pdf?hkey=6D3A4C79FDBF58556ACFDE234799DDF0; ComponentLink2URL: https://4donline.ihs.com/images/VipMasterIC/IC/MICT/MICT-S-A0014105731/MICT-S-A0014105731-1.pdf?hkey=6D3A4C79FDBF58556ACFDE234799DDF0

## Sheet micron_P6.SchDoc
size A; SheetNumber: 6; SheetTotal: 11
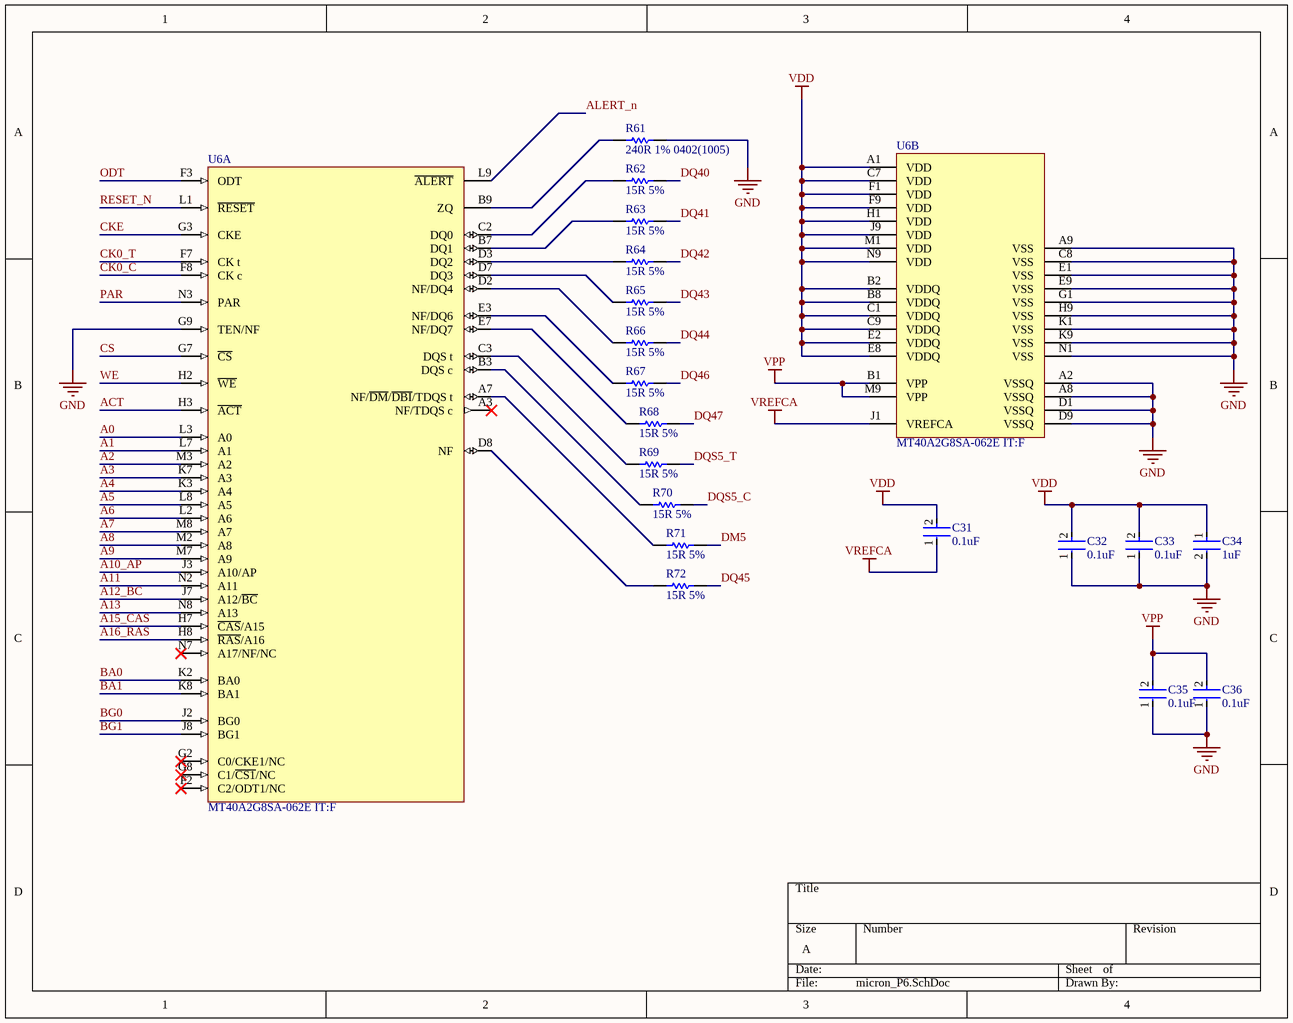
[diagram p5: micron_P6.SchDoc]

### Parts
C31  0.1uF  [FP-GRM15-MFG]
C32  0.1uF  [FP-GRM15-MFG]
C33  0.1uF  [FP-GRM15-MFG]
C34  1uF  [FP-CL511-IPC_C]
C35  0.1uF  [FP-GRM15-MFG]
C36  0.1uF  [FP-GRM15-MFG]
R61  240R 1% 0402(1005)  [RESC0402(1005)_L]
R62  15R 5%  [RESC1005X40X25LL05T10]
R63  15R 5%  [RESC1005X40X25LL05T10]
R64  15R 5%  [RESC1005X40X25LL05T10]
R65  15R 5%  [RESC1005X40X25LL05T10]
R66  15R 5%  [RESC1005X40X25LL05T10]
R67  15R 5%  [RESC1005X40X25LL05T10]
R68  15R 5%  [RESC1005X40X25LL05T10]
R69  15R 5%  [RESC1005X40X25LL05T10]
R70  15R 5%  [RESC1005X40X25LL05T10]
R71  15R 5%  [RESC1005X40X25LL05T10]
R72  15R 5%  [RESC1005X40X25LL05T10]
U6  MT40A2G8SA-062E IT:F  [SA_MFG]  (parts A,B of 2)

### Nets
GND: C32.1 C33.1 C34.2 C35.1 C36.1 R61.2 U6.A2(VSSQ) U6.A8(VSSQ) U6.A9(VSS) U6.C8(VSS) U6.D1(VSSQ) U6.D9(VSSQ) U6.E1(VSS) U6.E9(VSS) U6.G1(VSS) U6.G9(TEN/NF) U6.H9(VSS) U6.K1(VSS) U6.K9(VSS) U6.N1(VSS)
VDD: C31.2 C32.2 C33.2 C34.1 U6.A1(VDD) U6.B2(VDDQ) U6.B8(VDDQ) U6.C1(VDDQ) U6.C7(VDD) U6.C9(VDDQ) U6.E2(VDDQ) U6.E8(VDDQ) U6.F1(VDD) U6.F9(VDD) U6.H1(VDD) U6.J9(VDD) U6.M1(VDD) U6.N9(VDD)
VPP: C35.2 C36.2 U6.B1(VPP) U6.M9(VPP)
VREFCA: C31.1 U6.J1(VREFCA)
A0: U6.L3(A0)
A1: U6.L7(A1)
A2: U6.M3(A2)
A3: U6.K7(A3)
A4: U6.K3(A4)
A5: U6.L8(A5)
A6: U6.L2(A6)
A7: U6.M8(A7)
A8: U6.M2(A8)
A9: U6.M7(A9)
A10_AP: U6.J3(A10/AP)
A11: U6.N2(A11)
A12_BC: U6.J7(A12/~{BC})
A13: U6.N8(A13)
A15_CAS: U6.H7(~{CAS}/A15)
A16_RAS: U6.H8(~{RAS}/A16)
ACT: U6.H3(~{ACT})
ALERT_n: U6.L9(~{ALERT})
BA0: U6.K2(BA0)
BA1: U6.K8(BA1)
BG0: U6.J2(BG0)
BG1: U6.J8(BG1)
CK0_C: U6.F8(CK_c)
CK0_T: U6.F7(CK_t)
CKE: U6.G3(CKE)
CS: U6.G7(~{CS})
DM5: R71.2
DQ40: R62.2
DQ41: R63.2
DQ42: R64.2
DQ43: R65.2
DQ44: R66.2
DQ45: R72.2
DQ46: R67.2
DQ47: R68.2
DQS5_C: R70.2
DQS5_T: R69.2
ODT: U6.F3(ODT)
PAR: U6.N3(PAR)
RESET_N: U6.L1(~{RESET})
WE: U6.H2(~{WE})
NetR61_1: R61.1 U6.B9(ZQ)
NetR62_1: R62.1 U6.C2(DQ0)
NetR63_1: R63.1 U6.B7(DQ1)
NetR64_1: R64.1 U6.D3(DQ2)
NetR65_1: R65.1 U6.D7(DQ3)
NetR66_1: R66.1 U6.D2(NF/DQ4)
NetR67_1: R67.1 U6.E3(NF/DQ6)
NetR68_1: R68.1 U6.E7(NF/DQ7)
NetR69_1: R69.1 U6.C3(DQS_t)
NetR70_1: R70.1 U6.B3(DQS_c)
NetR71_1: R71.1 U6.A7(NF/~{DM}/~{DBI}/TDQS_t)
NetR72_1: R72.1 U6.D8(NF)

Not connected (* = marked no-connect by the designer): U6 A3(NF/TDQS_c)* F2(C2/ODT1/NC)* G2(C0/CKE1/NC)* G8(C1/~{CS1}/NC)* N7(A17/NF/NC)*

### Library data of the parts
C31-C33 C35 C36 = CMP-2100-03641-2: as C1 on sheet micron_ram; RoHS: TRUE; Temperature Characteristic: X7R; Octopart: https://octopart.com/grm155r71c104ka88d-murata-196880; Digikey Description: CAP CER 0.1UF 16V X7R 0402; Device Class L3: Ceramic Capacitors; Height: 0.55mm; ComponentLink2Description: Datasheet; Temperature Range Low: -55°C; Ipc Land Pattern Name: CAPC10050X219; ComponentLink2URL: https://search.murata.co.jp/Ceramy/image/img/A01X/G101/ENG/GRM155R71H471KA01-01A.pdf; Device Class L1: Passive Components; Lead Free: yes; Category: Cap; Package: GRM15; Temperature: -55°C to +125°C; Device Class L2: Capacitors; Temperature Range High: +125°C; Mouser Description: 0402 0.1 uF 16V ±10 % Tolerance X7R SMT Multilayer Ceramic Capacitor
C34 = CMP-13271-001936-1: as C4 on sheet micron_ram; Depth: 0.5mm; Case Code (Imperial): 0402; Material: Ceramic; Mount: Surface Mount; Thickness: 0.022inch; Dielectric: X5R; Capacitance: 1uF; Radiation Hardening: No; Case/Package: 0402; Length: 1mm; Tolerance: 10%; Max Operating Temperature: 85°C; Package Quantity: 1; Width: 0.02inch; Voltage Rating: 10V; Contact Plating: Tin; Height: 0.5mm; Min Operating Temperature: -55°C; Case Code (Metric): 1005; Packaging: Tape and Reel
R61 = CMP-1011-00438-1: as R1 on sheet micron_ram; Power: 0.063 W; Tolerance: 1 %; Technology: SMT
R62-R72 = CMP-2002-07413-1: as R2 on sheet micron_ram
U6 = CMP-00526-125391410-1: as U1 on sheet micron_ram; ComponentLink1URL: http://www.micron.com/; ComponentLink3Description: Manufacturer's Package Drawing; ComponentLink2Description: Datasheet URL; ComponentLink1Description: Manufacturer's Website; ComponentLink3URL: https://www.micron.com/content/dam/micron/global/public/products/customer-service-note/csn33-bga-user-guide.pdf; HelpURL: https://4donline.ihs.com/images/VipMasterIC/IC/MICT/MICT-S-A0014105731/MICT-S-A0014105731-1.pdf?hkey=6D3A4C79FDBF58556ACFDE234799DDF0; ComponentLink2URL: https://4donline.ihs.com/images/VipMasterIC/IC/MICT/MICT-S-A0014105731/MICT-S-A0014105731-1.pdf?hkey=6D3A4C79FDBF58556ACFDE234799DDF0

## Sheet micron_P7.SchDoc
size A; SheetNumber: 7; SheetTotal: 11
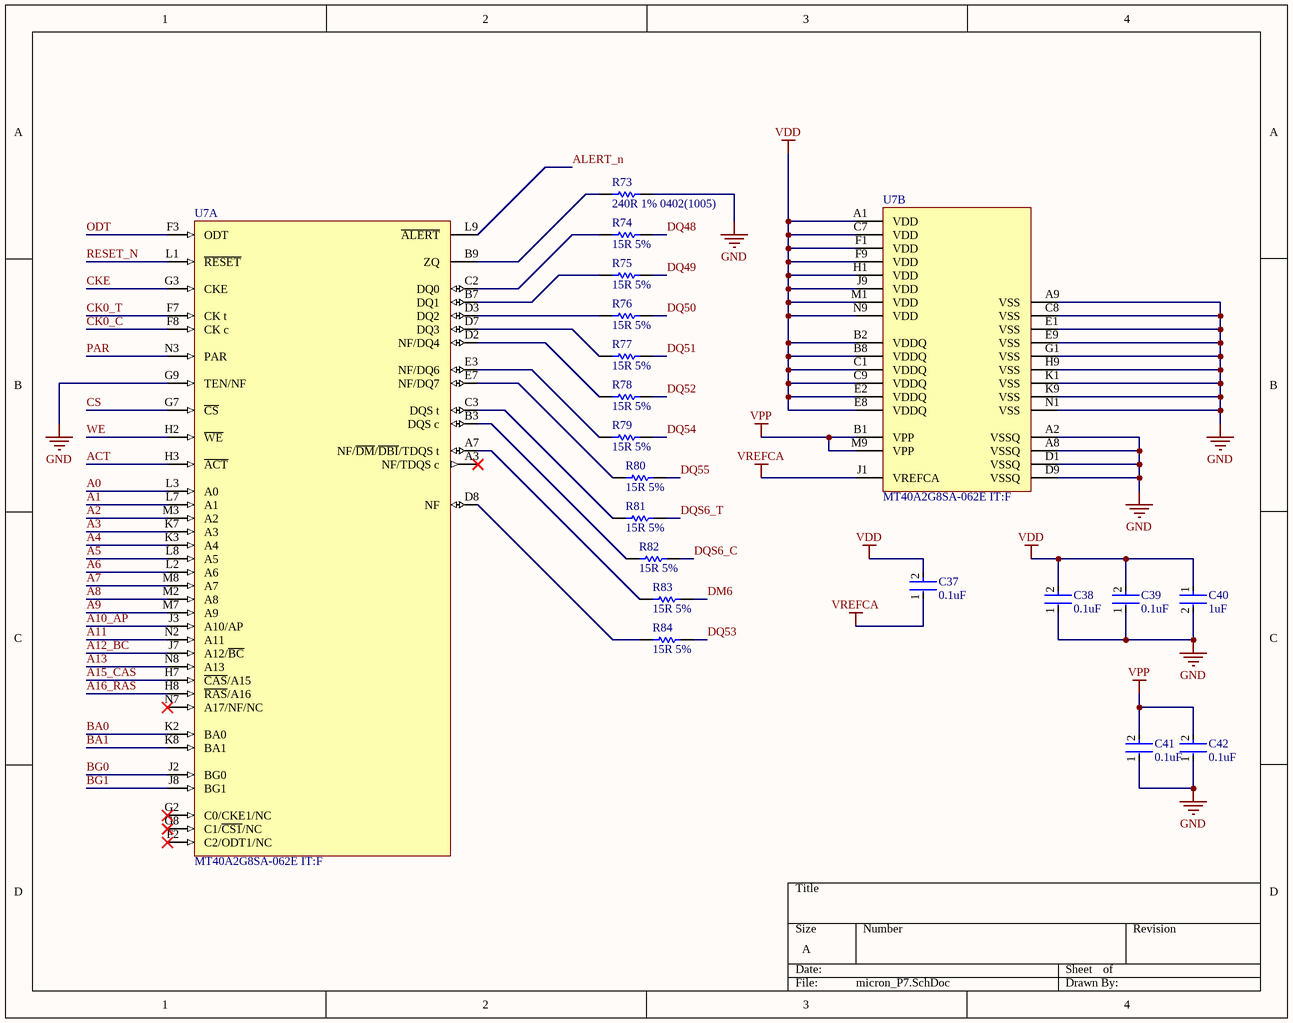
[diagram p6: micron_P7.SchDoc]

### Parts
C37  0.1uF  [FP-GRM15-MFG]
C38  0.1uF  [FP-GRM15-MFG]
C39  0.1uF  [FP-GRM15-MFG]
C40  1uF  [FP-CL511-IPC_C]
C41  0.1uF  [FP-GRM15-MFG]
C42  0.1uF  [FP-GRM15-MFG]
R73  240R 1% 0402(1005)  [RESC0402(1005)_L]
R74  15R 5%  [RESC1005X40X25LL05T10]
R75  15R 5%  [RESC1005X40X25LL05T10]
R76  15R 5%  [RESC1005X40X25LL05T10]
R77  15R 5%  [RESC1005X40X25LL05T10]
R78  15R 5%  [RESC1005X40X25LL05T10]
R79  15R 5%  [RESC1005X40X25LL05T10]
R80  15R 5%  [RESC1005X40X25LL05T10]
R81  15R 5%  [RESC1005X40X25LL05T10]
R82  15R 5%  [RESC1005X40X25LL05T10]
R83  15R 5%  [RESC1005X40X25LL05T10]
R84  15R 5%  [RESC1005X40X25LL05T10]
U7  MT40A2G8SA-062E IT:F  [SA_MFG]  (parts A,B of 2)

### Nets
GND: C38.1 C39.1 C40.2 C41.1 C42.1 R73.2 U7.A2(VSSQ) U7.A8(VSSQ) U7.A9(VSS) U7.C8(VSS) U7.D1(VSSQ) U7.D9(VSSQ) U7.E1(VSS) U7.E9(VSS) U7.G1(VSS) U7.G9(TEN/NF) U7.H9(VSS) U7.K1(VSS) U7.K9(VSS) U7.N1(VSS)
VDD: C37.2 C38.2 C39.2 C40.1 U7.A1(VDD) U7.B2(VDDQ) U7.B8(VDDQ) U7.C1(VDDQ) U7.C7(VDD) U7.C9(VDDQ) U7.E2(VDDQ) U7.E8(VDDQ) U7.F1(VDD) U7.F9(VDD) U7.H1(VDD) U7.J9(VDD) U7.M1(VDD) U7.N9(VDD)
VPP: C41.2 C42.2 U7.B1(VPP) U7.M9(VPP)
VREFCA: C37.1 U7.J1(VREFCA)
A0: U7.L3(A0)
A1: U7.L7(A1)
A2: U7.M3(A2)
A3: U7.K7(A3)
A4: U7.K3(A4)
A5: U7.L8(A5)
A6: U7.L2(A6)
A7: U7.M8(A7)
A8: U7.M2(A8)
A9: U7.M7(A9)
A10_AP: U7.J3(A10/AP)
A11: U7.N2(A11)
A12_BC: U7.J7(A12/~{BC})
A13: U7.N8(A13)
A15_CAS: U7.H7(~{CAS}/A15)
A16_RAS: U7.H8(~{RAS}/A16)
ACT: U7.H3(~{ACT})
ALERT_n: U7.L9(~{ALERT})
BA0: U7.K2(BA0)
BA1: U7.K8(BA1)
BG0: U7.J2(BG0)
BG1: U7.J8(BG1)
CK0_C: U7.F8(CK_c)
CK0_T: U7.F7(CK_t)
CKE: U7.G3(CKE)
CS: U7.G7(~{CS})
DM6: R83.2
DQ48: R74.2
DQ49: R75.2
DQ50: R76.2
DQ51: R77.2
DQ52: R78.2
DQ53: R84.2
DQ54: R79.2
DQ55: R80.2
DQS6_C: R82.2
DQS6_T: R81.2
ODT: U7.F3(ODT)
PAR: U7.N3(PAR)
RESET_N: U7.L1(~{RESET})
WE: U7.H2(~{WE})
NetR73_1: R73.1 U7.B9(ZQ)
NetR74_1: R74.1 U7.C2(DQ0)
NetR75_1: R75.1 U7.B7(DQ1)
NetR76_1: R76.1 U7.D3(DQ2)
NetR77_1: R77.1 U7.D7(DQ3)
NetR78_1: R78.1 U7.D2(NF/DQ4)
NetR79_1: R79.1 U7.E3(NF/DQ6)
NetR80_1: R80.1 U7.E7(NF/DQ7)
NetR81_1: R81.1 U7.C3(DQS_t)
NetR82_1: R82.1 U7.B3(DQS_c)
NetR83_1: R83.1 U7.A7(NF/~{DM}/~{DBI}/TDQS_t)
NetR84_1: R84.1 U7.D8(NF)

Not connected (* = marked no-connect by the designer): U7 A3(NF/TDQS_c)* F2(C2/ODT1/NC)* G2(C0/CKE1/NC)* G8(C1/~{CS1}/NC)* N7(A17/NF/NC)*

### Library data of the parts
C37-C39 C41 C42 = CMP-2100-03641-2: as C1 on sheet micron_ram; RoHS: TRUE; Temperature Characteristic: X7R; Octopart: https://octopart.com/grm155r71c104ka88d-murata-196880; Digikey Description: CAP CER 0.1UF 16V X7R 0402; Device Class L3: Ceramic Capacitors; Height: 0.55mm; ComponentLink2Description: Datasheet; Temperature Range Low: -55°C; Ipc Land Pattern Name: CAPC10050X219; ComponentLink2URL: https://search.murata.co.jp/Ceramy/image/img/A01X/G101/ENG/GRM155R71H471KA01-01A.pdf; Device Class L1: Passive Components; Lead Free: yes; Category: Cap; Package: GRM15; Temperature: -55°C to +125°C; Device Class L2: Capacitors; Temperature Range High: +125°C; Mouser Description: 0402 0.1 uF 16V ±10 % Tolerance X7R SMT Multilayer Ceramic Capacitor
C40 = CMP-13271-001936-1: as C4 on sheet micron_ram; Depth: 0.5mm; Case Code (Imperial): 0402; Material: Ceramic; Mount: Surface Mount; Thickness: 0.022inch; Dielectric: X5R; Capacitance: 1uF; Radiation Hardening: No; Case/Package: 0402; Length: 1mm; Tolerance: 10%; Max Operating Temperature: 85°C; Package Quantity: 1; Width: 0.02inch; Voltage Rating: 10V; Contact Plating: Tin; Height: 0.5mm; Min Operating Temperature: -55°C; Case Code (Metric): 1005; Packaging: Tape and Reel
R73 = CMP-1011-00438-1: as R1 on sheet micron_ram; Power: 0.063 W; Tolerance: 1 %; Technology: SMT
R74-R84 = CMP-2002-07413-1: as R2 on sheet micron_ram
U7 = CMP-00526-125391410-1: as U1 on sheet micron_ram; ComponentLink1URL: http://www.micron.com/; ComponentLink3Description: Manufacturer's Package Drawing; ComponentLink2Description: Datasheet URL; ComponentLink1Description: Manufacturer's Website; ComponentLink3URL: https://www.micron.com/content/dam/micron/global/public/products/customer-service-note/csn33-bga-user-guide.pdf; HelpURL: https://4donline.ihs.com/images/VipMasterIC/IC/MICT/MICT-S-A0014105731/MICT-S-A0014105731-1.pdf?hkey=6D3A4C79FDBF58556ACFDE234799DDF0; ComponentLink2URL: https://4donline.ihs.com/images/VipMasterIC/IC/MICT/MICT-S-A0014105731/MICT-S-A0014105731-1.pdf?hkey=6D3A4C79FDBF58556ACFDE234799DDF0

## Sheet micron_P8.SchDoc
size A; SheetNumber: 8; SheetTotal: 11
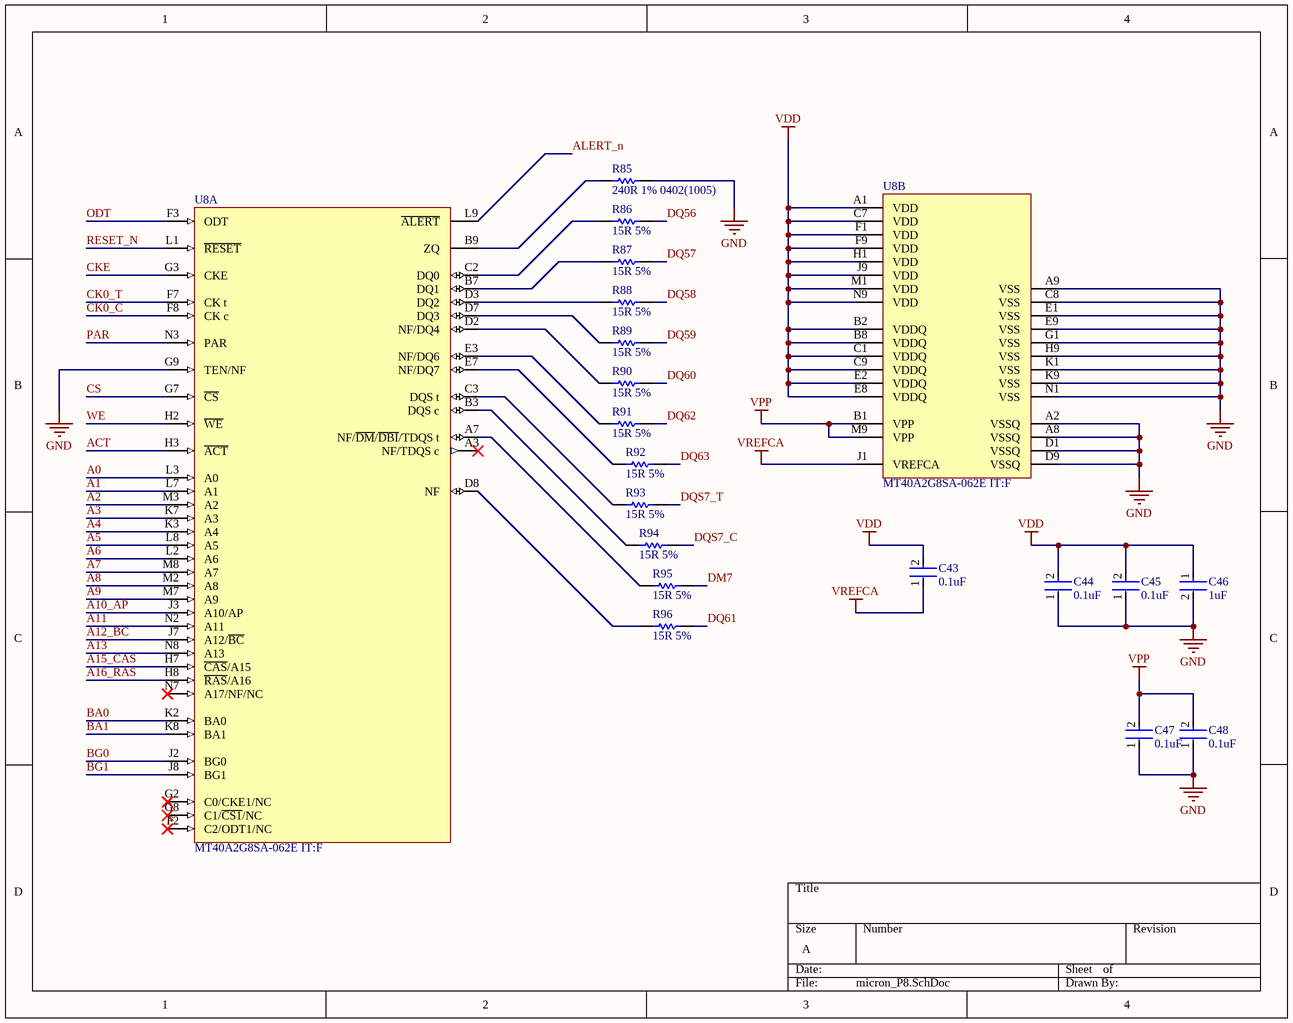
[diagram p7: micron_P8.SchDoc]

### Parts
C43  0.1uF  [FP-GRM15-MFG]
C44  0.1uF  [FP-GRM15-MFG]
C45  0.1uF  [FP-GRM15-MFG]
C46  1uF  [FP-CL511-IPC_C]
C47  0.1uF  [FP-GRM15-MFG]
C48  0.1uF  [FP-GRM15-MFG]
R85  240R 1% 0402(1005)  [RESC0402(1005)_L]
R86  15R 5%  [RESC1005X40X25LL05T10]
R87  15R 5%  [RESC1005X40X25LL05T10]
R88  15R 5%  [RESC1005X40X25LL05T10]
R89  15R 5%  [RESC1005X40X25LL05T10]
R90  15R 5%  [RESC1005X40X25LL05T10]
R91  15R 5%  [RESC1005X40X25LL05T10]
R92  15R 5%  [RESC1005X40X25LL05T10]
R93  15R 5%  [RESC1005X40X25LL05T10]
R94  15R 5%  [RESC1005X40X25LL05T10]
R95  15R 5%  [RESC1005X40X25LL05T10]
R96  15R 5%  [RESC1005X40X25LL05T10]
U8  MT40A2G8SA-062E IT:F  [SA_MFG]  (parts A,B of 2)

### Nets
GND: C44.1 C45.1 C46.2 C47.1 C48.1 R85.2 U8.A2(VSSQ) U8.A8(VSSQ) U8.A9(VSS) U8.C8(VSS) U8.D1(VSSQ) U8.D9(VSSQ) U8.E1(VSS) U8.E9(VSS) U8.G1(VSS) U8.G9(TEN/NF) U8.H9(VSS) U8.K1(VSS) U8.K9(VSS) U8.N1(VSS)
VDD: C43.2 C44.2 C45.2 C46.1 U8.A1(VDD) U8.B2(VDDQ) U8.B8(VDDQ) U8.C1(VDDQ) U8.C7(VDD) U8.C9(VDDQ) U8.E2(VDDQ) U8.E8(VDDQ) U8.F1(VDD) U8.F9(VDD) U8.H1(VDD) U8.J9(VDD) U8.M1(VDD) U8.N9(VDD)
VPP: C47.2 C48.2 U8.B1(VPP) U8.M9(VPP)
VREFCA: C43.1 U8.J1(VREFCA)
A0: U8.L3(A0)
A1: U8.L7(A1)
A2: U8.M3(A2)
A3: U8.K7(A3)
A4: U8.K3(A4)
A5: U8.L8(A5)
A6: U8.L2(A6)
A7: U8.M8(A7)
A8: U8.M2(A8)
A9: U8.M7(A9)
A10_AP: U8.J3(A10/AP)
A11: U8.N2(A11)
A12_BC: U8.J7(A12/~{BC})
A13: U8.N8(A13)
A15_CAS: U8.H7(~{CAS}/A15)
A16_RAS: U8.H8(~{RAS}/A16)
ACT: U8.H3(~{ACT})
ALERT_n: U8.L9(~{ALERT})
BA0: U8.K2(BA0)
BA1: U8.K8(BA1)
BG0: U8.J2(BG0)
BG1: U8.J8(BG1)
CK0_C: U8.F8(CK_c)
CK0_T: U8.F7(CK_t)
CKE: U8.G3(CKE)
CS: U8.G7(~{CS})
DM7: R95.2
DQ56: R86.2
DQ57: R87.2
DQ58: R88.2
DQ59: R89.2
DQ60: R90.2
DQ61: R96.2
DQ62: R91.2
DQ63: R92.2
DQS7_C: R94.2
DQS7_T: R93.2
ODT: U8.F3(ODT)
PAR: U8.N3(PAR)
RESET_N: U8.L1(~{RESET})
WE: U8.H2(~{WE})
NetR85_1: R85.1 U8.B9(ZQ)
NetR86_1: R86.1 U8.C2(DQ0)
NetR87_1: R87.1 U8.B7(DQ1)
NetR88_1: R88.1 U8.D3(DQ2)
NetR89_1: R89.1 U8.D7(DQ3)
NetR90_1: R90.1 U8.D2(NF/DQ4)
NetR91_1: R91.1 U8.E3(NF/DQ6)
NetR92_1: R92.1 U8.E7(NF/DQ7)
NetR93_1: R93.1 U8.C3(DQS_t)
NetR94_1: R94.1 U8.B3(DQS_c)
NetR95_1: R95.1 U8.A7(NF/~{DM}/~{DBI}/TDQS_t)
NetR96_1: R96.1 U8.D8(NF)

Not connected (* = marked no-connect by the designer): U8 A3(NF/TDQS_c)* F2(C2/ODT1/NC)* G2(C0/CKE1/NC)* G8(C1/~{CS1}/NC)* N7(A17/NF/NC)*

### Library data of the parts
C43-C45 C47 C48 = CMP-2100-03641-2: as C1 on sheet micron_ram; RoHS: TRUE; Temperature Characteristic: X7R; Octopart: https://octopart.com/grm155r71c104ka88d-murata-196880; Digikey Description: CAP CER 0.1UF 16V X7R 0402; Device Class L3: Ceramic Capacitors; Height: 0.55mm; ComponentLink2Description: Datasheet; Temperature Range Low: -55°C; Ipc Land Pattern Name: CAPC10050X219; ComponentLink2URL: https://search.murata.co.jp/Ceramy/image/img/A01X/G101/ENG/GRM155R71H471KA01-01A.pdf; Device Class L1: Passive Components; Lead Free: yes; Category: Cap; Package: GRM15; Temperature: -55°C to +125°C; Device Class L2: Capacitors; Temperature Range High: +125°C; Mouser Description: 0402 0.1 uF 16V ±10 % Tolerance X7R SMT Multilayer Ceramic Capacitor
C46 = CMP-13271-001936-1: as C4 on sheet micron_ram; Depth: 0.5mm; Case Code (Imperial): 0402; Material: Ceramic; Mount: Surface Mount; Thickness: 0.022inch; Dielectric: X5R; Capacitance: 1uF; Radiation Hardening: No; Case/Package: 0402; Length: 1mm; Tolerance: 10%; Max Operating Temperature: 85°C; Package Quantity: 1; Width: 0.02inch; Voltage Rating: 10V; Contact Plating: Tin; Height: 0.5mm; Min Operating Temperature: -55°C; Case Code (Metric): 1005; Packaging: Tape and Reel
R85 = CMP-1011-00438-1: as R1 on sheet micron_ram; Power: 0.063 W; Tolerance: 1 %; Technology: SMT
R86-R96 = CMP-2002-07413-1: as R2 on sheet micron_ram
U8 = CMP-00526-125391410-1: as U1 on sheet micron_ram; ComponentLink1URL: http://www.micron.com/; ComponentLink3Description: Manufacturer's Package Drawing; ComponentLink2Description: Datasheet URL; ComponentLink1Description: Manufacturer's Website; ComponentLink3URL: https://www.micron.com/content/dam/micron/global/public/products/customer-service-note/csn33-bga-user-guide.pdf; HelpURL: https://4donline.ihs.com/images/VipMasterIC/IC/MICT/MICT-S-A0014105731/MICT-S-A0014105731-1.pdf?hkey=6D3A4C79FDBF58556ACFDE234799DDF0; ComponentLink2URL: https://4donline.ihs.com/images/VipMasterIC/IC/MICT/MICT-S-A0014105731/MICT-S-A0014105731-1.pdf?hkey=6D3A4C79FDBF58556ACFDE234799DDF0

## Sheet edge.SchDoc
size A3; SheetNumber: 9; SheetTotal: 11
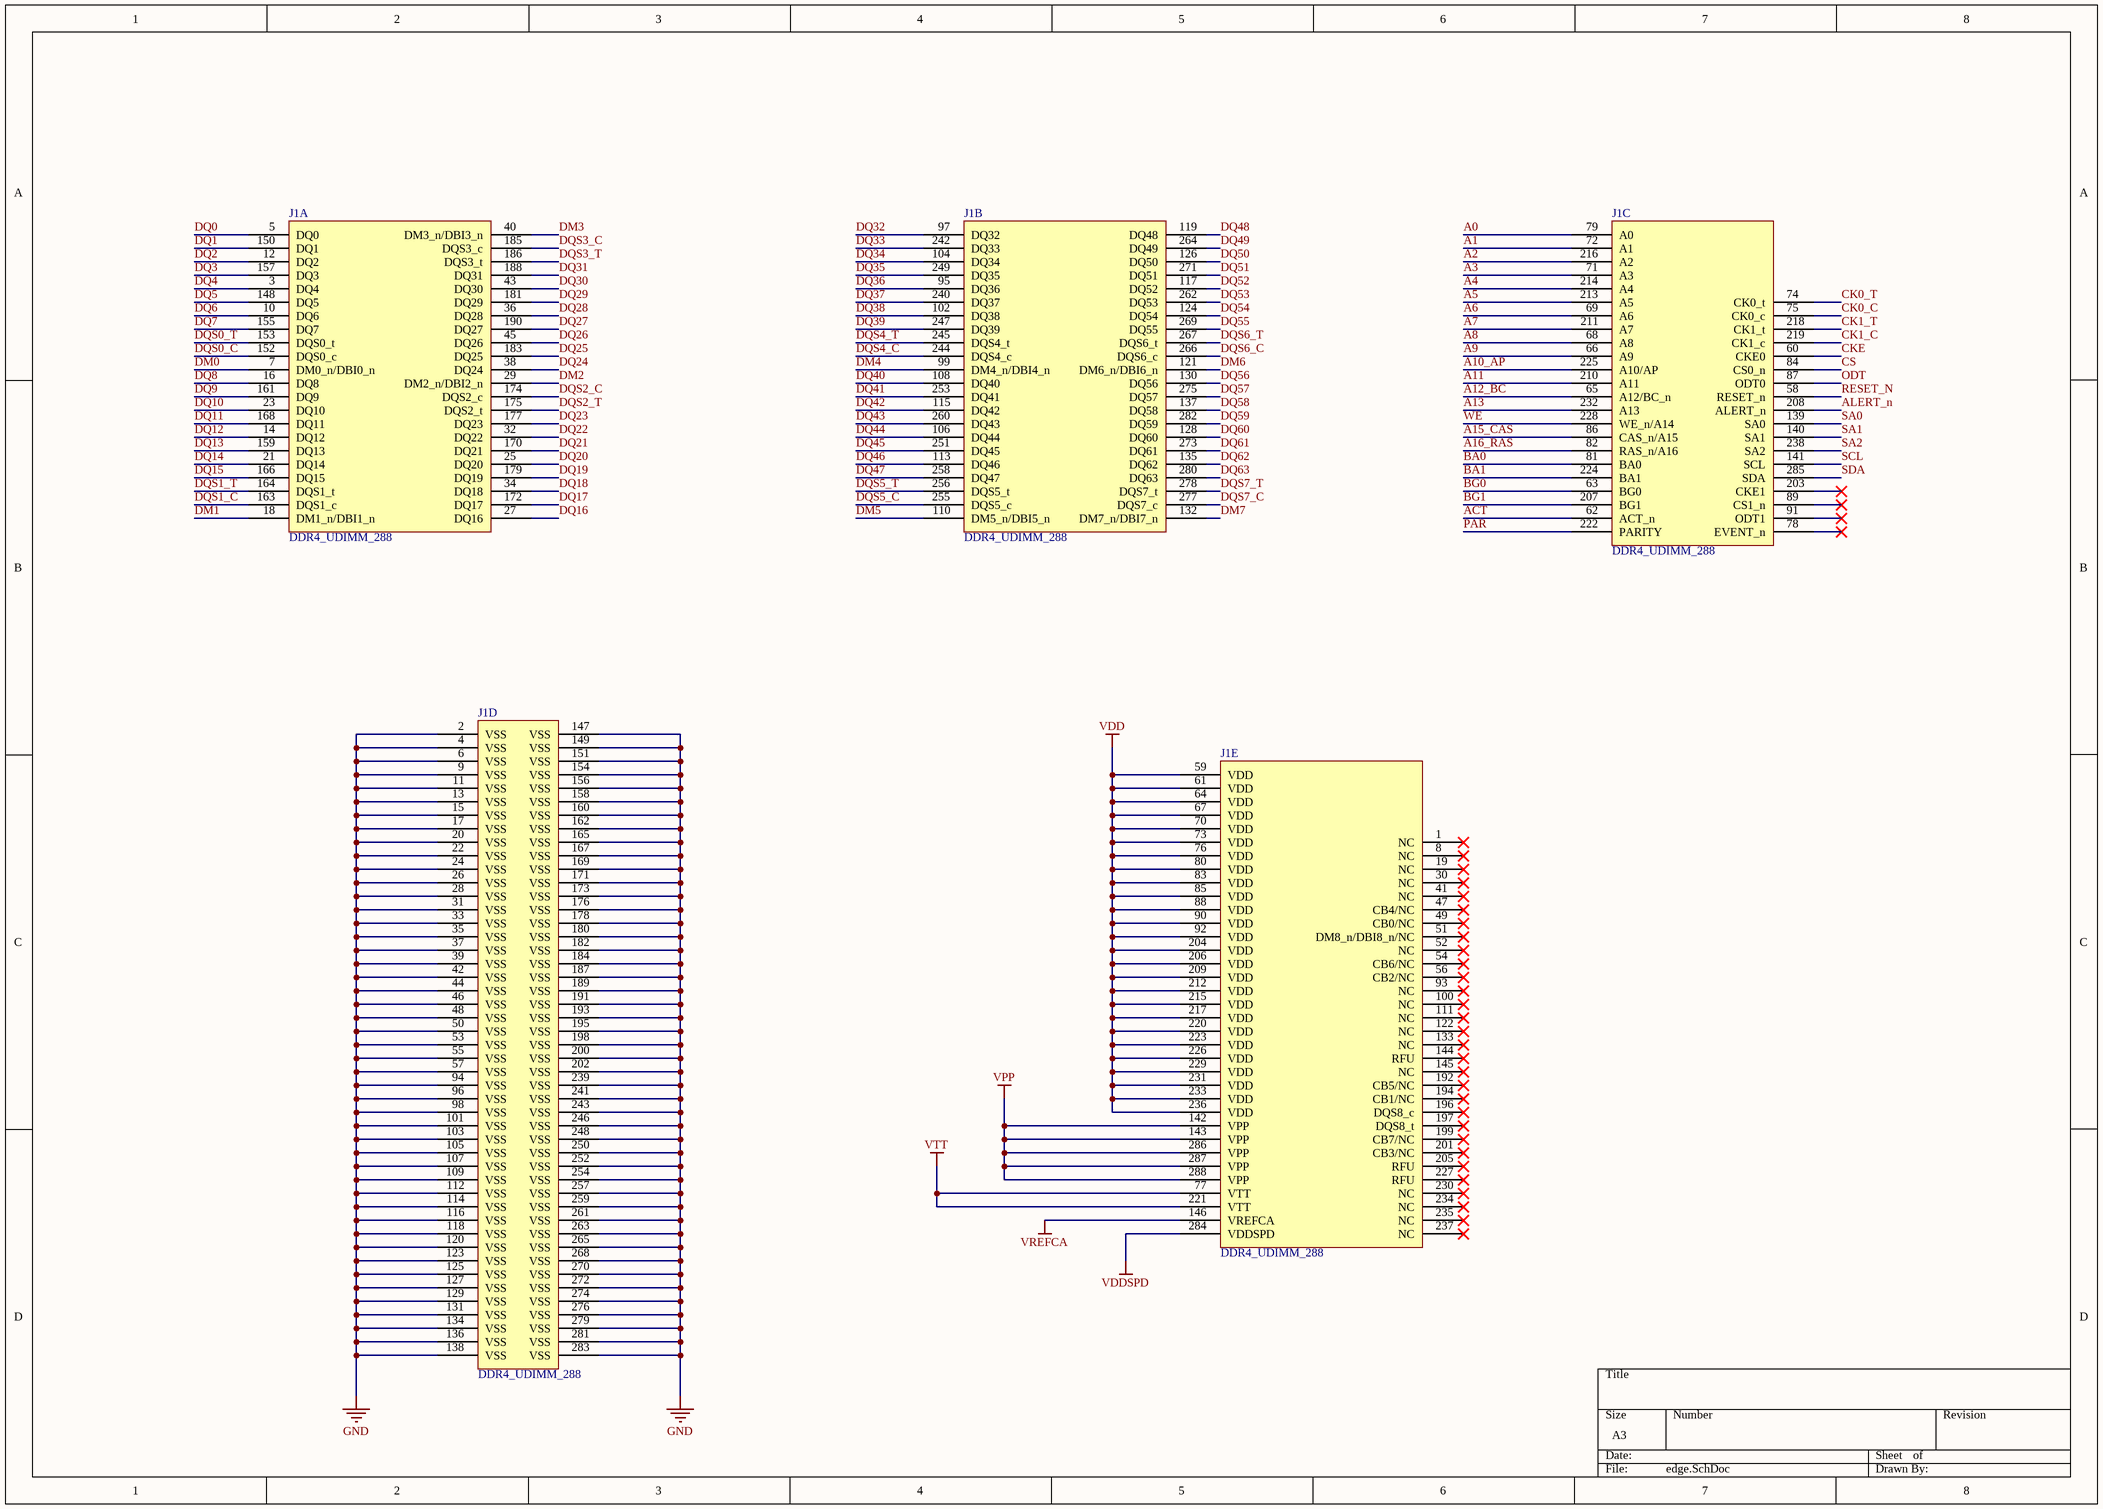
[diagram p8: edge.SchDoc]

### Parts
J1  DDR4_UDIMM_288  [DDR4_UDIMM_288_MO309]  (parts A,B,C,D,E of 5)

### Nets
GND: J1.2(VSS) J1.4(VSS) J1.6(VSS) J1.9(VSS) J1.11(VSS) J1.13(VSS) J1.15(VSS) J1.17(VSS) J1.20(VSS) J1.22(VSS) J1.24(VSS) J1.26(VSS) J1.28(VSS) J1.31(VSS) J1.33(VSS) J1.35(VSS) J1.37(VSS) J1.39(VSS) J1.42(VSS) J1.44(VSS) J1.46(VSS) J1.48(VSS) J1.50(VSS) J1.53(VSS) J1.55(VSS) J1.57(VSS) J1.94(VSS) J1.96(VSS) J1.98(VSS) J1.101(VSS) J1.103(VSS) J1.105(VSS) J1.107(VSS) J1.109(VSS) J1.112(VSS) J1.114(VSS) J1.116(VSS) J1.118(VSS) J1.120(VSS) J1.123(VSS) J1.125(VSS) J1.127(VSS) J1.129(VSS) J1.131(VSS) J1.134(VSS) J1.136(VSS) J1.138(VSS) J1.147(VSS) J1.149(VSS) J1.151(VSS) J1.154(VSS) J1.156(VSS) J1.158(VSS) J1.160(VSS) J1.162(VSS) J1.165(VSS) J1.167(VSS) J1.169(VSS) J1.171(VSS) J1.173(VSS) J1.176(VSS) J1.178(VSS) J1.180(VSS) J1.182(VSS) J1.184(VSS) J1.187(VSS) J1.189(VSS) J1.191(VSS) J1.193(VSS) J1.195(VSS) J1.198(VSS) J1.200(VSS) J1.202(VSS) J1.239(VSS) J1.241(VSS) J1.243(VSS) J1.246(VSS) J1.248(VSS) J1.250(VSS) J1.252(VSS) J1.254(VSS) J1.257(VSS) J1.259(VSS) J1.261(VSS) J1.263(VSS) J1.265(VSS) J1.268(VSS) J1.270(VSS) J1.272(VSS) J1.274(VSS) J1.276(VSS) J1.279(VSS) J1.281(VSS) J1.283(VSS)
VDD: J1.59(VDD) J1.61(VDD) J1.64(VDD) J1.67(VDD) J1.70(VDD) J1.73(VDD) J1.76(VDD) J1.80(VDD) J1.83(VDD) J1.85(VDD) J1.88(VDD) J1.90(VDD) J1.92(VDD) J1.204(VDD) J1.206(VDD) J1.209(VDD) J1.212(VDD) J1.215(VDD) J1.217(VDD) J1.220(VDD) J1.223(VDD) J1.226(VDD) J1.229(VDD) J1.231(VDD) J1.233(VDD) J1.236(VDD)
VDDSPD: J1.284(VDDSPD)
VPP: J1.142(VPP) J1.143(VPP) J1.286(VPP) J1.287(VPP) J1.288(VPP)
VREFCA: J1.146(VREFCA)
VTT: J1.77(VTT) J1.221(VTT)
A0: J1.79(A0)
A1: J1.72(A1)
A2: J1.216(A2)
A3: J1.71(A3)
A4: J1.214(A4)
A5: J1.213(A5)
A6: J1.69(A6)
A7: J1.211(A7)
A8: J1.68(A8)
A9: J1.66(A9)
A10_AP: J1.225(A10/AP)
A11: J1.210(A11)
A12_BC: J1.65(A12/BC_n)
A13: J1.232(A13)
A15_CAS: J1.86(CAS_n/A15)
A16_RAS: J1.82(RAS_n/A16)
ACT: J1.62(ACT_n)
ALERT_n: J1.208(ALERT_n)
BA0: J1.81(BA0)
BA1: J1.224(BA1)
BG0: J1.63(BG0)
BG1: J1.207(BG1)
CK0_C: J1.75(CK0_c)
CK0_T: J1.74(CK0_t)
CK1_C: J1.219(CK1_c)
CK1_T: J1.218(CK1_t)
CKE: J1.60(CKE0)
CS: J1.84(CS0_n)
DM0: J1.7(DM0_n/DBI0_n)
DM1: J1.18(DM1_n/DBI1_n)
DM2: J1.29(DM2_n/DBI2_n)
DM3: J1.40(DM3_n/DBI3_n)
DM4: J1.99(DM4_n/DBI4_n)
DM5: J1.110(DM5_n/DBI5_n)
DM6: J1.121(DM6_n/DBI6_n)
DM7: J1.132(DM7_n/DBI7_n)
DQ0: J1.5(DQ0)
DQ1: J1.150(DQ1)
DQ2: J1.12(DQ2)
DQ3: J1.157(DQ3)
DQ4: J1.3(DQ4)
DQ5: J1.148(DQ5)
DQ6: J1.10(DQ6)
DQ7: J1.155(DQ7)
DQ8: J1.16(DQ8)
DQ9: J1.161(DQ9)
DQ10: J1.23(DQ10)
DQ11: J1.168(DQ11)
DQ12: J1.14(DQ12)
DQ13: J1.159(DQ13)
DQ14: J1.21(DQ14)
DQ15: J1.166(DQ15)
DQ16: J1.27(DQ16)
DQ17: J1.172(DQ17)
DQ18: J1.34(DQ18)
DQ19: J1.179(DQ19)
DQ20: J1.25(DQ20)
DQ21: J1.170(DQ21)
DQ22: J1.32(DQ22)
DQ23: J1.177(DQ23)
DQ24: J1.38(DQ24)
DQ25: J1.183(DQ25)
DQ26: J1.45(DQ26)
DQ27: J1.190(DQ27)
DQ28: J1.36(DQ28)
DQ29: J1.181(DQ29)
DQ30: J1.43(DQ30)
DQ31: J1.188(DQ31)
DQ32: J1.97(DQ32)
DQ33: J1.242(DQ33)
DQ34: J1.104(DQ34)
DQ35: J1.249(DQ35)
DQ36: J1.95(DQ36)
DQ37: J1.240(DQ37)
DQ38: J1.102(DQ38)
DQ39: J1.247(DQ39)
DQ40: J1.108(DQ40)
DQ41: J1.253(DQ41)
DQ42: J1.115(DQ42)
DQ43: J1.260(DQ43)
DQ44: J1.106(DQ44)
DQ45: J1.251(DQ45)
DQ46: J1.113(DQ46)
DQ47: J1.258(DQ47)
DQ48: J1.119(DQ48)
DQ49: J1.264(DQ49)
DQ50: J1.126(DQ50)
DQ51: J1.271(DQ51)
DQ52: J1.117(DQ52)
DQ53: J1.262(DQ53)
DQ54: J1.124(DQ54)
DQ55: J1.269(DQ55)
DQ56: J1.130(DQ56)
DQ57: J1.275(DQ57)
DQ58: J1.137(DQ58)
DQ59: J1.282(DQ59)
DQ60: J1.128(DQ60)
DQ61: J1.273(DQ61)
DQ62: J1.135(DQ62)
DQ63: J1.280(DQ63)
DQS0_C: J1.152(DQS0_c)
DQS0_T: J1.153(DQS0_t)
DQS1_C: J1.163(DQS1_c)
DQS1_T: J1.164(DQS1_t)
DQS2_C: J1.174(DQS2_c)
DQS2_T: J1.175(DQS2_t)
DQS3_C: J1.185(DQS3_c)
DQS3_T: J1.186(DQS3_t)
DQS4_C: J1.244(DQS4_c)
DQS4_T: J1.245(DQS4_t)
DQS5_C: J1.255(DQS5_c)
DQS5_T: J1.256(DQS5_t)
DQS6_C: J1.266(DQS6_c)
DQS6_T: J1.267(DQS6_t)
DQS7_C: J1.277(DQS7_c)
DQS7_T: J1.278(DQS7_t)
ODT: J1.87(ODT0)
PAR: J1.222(PARITY)
RESET_N: J1.58(RESET_n)
SA0: J1.139(SA0)
SA1: J1.140(SA1)
SA2: J1.238(SA2)
SCL: J1.141(SCL)
SDA: J1.285(SDA)
WE: J1.228(WE_n/A14)

Not connected (* = marked no-connect by the designer): J1 1(NC)* 8(NC)* 19(NC)* 30(NC)* 41(NC)* 47(CB4/NC)* 49(CB0/NC)* 51(DM8_n/DBI8_n/NC)* 52(NC)* 54(CB6/NC)* 56(CB2/NC)* 78(EVENT_n)* 89(CS1_n)* 91(ODT1)* 93(NC)* 100(NC)* 111(NC)* 122(NC)* 133(NC)* 144(RFU)* 145(NC)* 192(CB5/NC)* 194(CB1/NC)* 196(DQS8_c)* 197(DQS8_t)* 199(CB7/NC)* 201(CB3/NC)* 203(CKE1)* 205(RFU)* 227(RFU)* 230(NC)* 234(NC)* 235(NC)* 237(NC)*

### Library data of the parts
J1 = Component_1: DDR4 288-pin UDIMM edge fingers, 0.85 mm pitch (JEDEC MO-309)

## Sheet SPD.SchDoc
size A; SheetNumber: 10; SheetTotal: 11
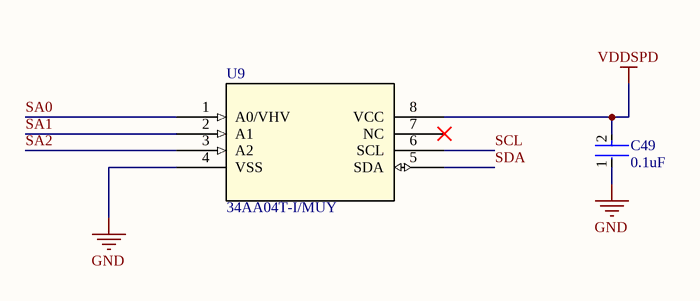
[diagram p9: SPD.SchDoc]

### Parts
C49  0.1uF  [FP-GRM15-MFG]
U9  34AA04T-I/MUY  [UDFN8_2x3MC_MCH]

### Nets
GND: C49.1 U9.4(VSS)
VDDSPD: C49.2 U9.8(VCC)
SA0: U9.1(A0/VHV)
SA1: U9.2(A1)
SA2: U9.3(A2)
SCL: U9.6(SCL)
SDA: U9.5(SDA)

Not connected (* = marked no-connect by the designer): U9 7(NC)*

### Library data of the parts
C49 = CMP-2100-03641-2: as C1 on sheet micron_ram; RoHS: TRUE; Temperature Characteristic: X7R; Octopart: https://octopart.com/grm155r71c104ka88d-murata-196880; Digikey Description: CAP CER 0.1UF 16V X7R 0402; Device Class L3: Ceramic Capacitors; Height: 0.55mm; ComponentLink2Description: Datasheet; Temperature Range Low: -55°C; Ipc Land Pattern Name: CAPC10050X219; ComponentLink2URL: https://search.murata.co.jp/Ceramy/image/img/A01X/G101/ENG/GRM155R71H471KA01-01A.pdf; Device Class L1: Passive Components; Lead Free: yes; Category: Cap; Package: GRM15; Temperature: -55°C to +125°C; Device Class L2: Capacitors; Temperature Range High: +125°C; Mouser Description: 0402 0.1 uF 16V ±10 % Tolerance X7R SMT Multilayer Ceramic Capacitor
U9 = 34AA04T-IMUY: No Description Available; Manufacturer_Name: Microchip; Copyright: Copyright (C) 2026 Ultra Librarian. All rights reserved.; Manufacturer_Part_Number: 34AA04T-I/MUY; RefDes: RefDes; Type: Type

## Sheet TERM.SchDoc
size A; SheetNumber: 11; SheetTotal: 11
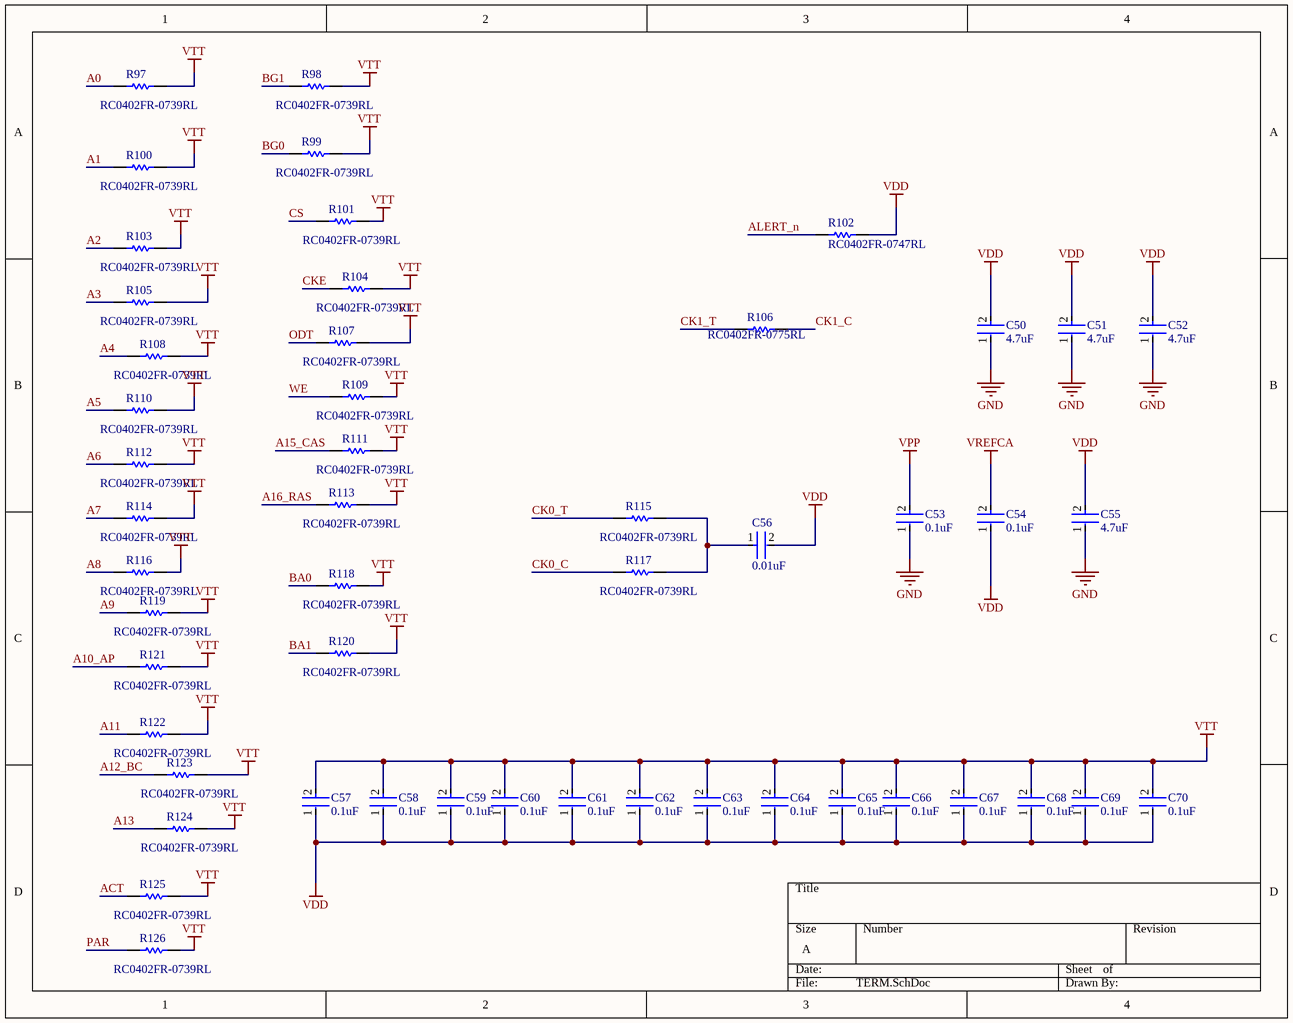
[diagram p10: TERM.SchDoc]

### Parts
C50  4.7uF  [FP-C1608-080-0_1-IPC_C]
C51  4.7uF  [FP-C1608-080-0_1-IPC_C]
C52  4.7uF  [FP-C1608-080-0_1-IPC_C]
C53  0.1uF  [FP-GRM15-MFG]
C54  0.1uF  [FP-GRM15-MFG]
C55  4.7uF  [FP-C1608-080-0_1-IPC_C]
C56  0.01uF  [FP-GRM155-0_05-IPC_C]
C57  0.1uF  [FP-GRM15-MFG]
C58  0.1uF  [FP-GRM15-MFG]
C59  0.1uF  [FP-GRM15-MFG]
C60  0.1uF  [FP-GRM15-MFG]
C61  0.1uF  [FP-GRM15-MFG]
C62  0.1uF  [FP-GRM15-MFG]
C63  0.1uF  [FP-GRM15-MFG]
C64  0.1uF  [FP-GRM15-MFG]
C65  0.1uF  [FP-GRM15-MFG]
C66  0.1uF  [FP-GRM15-MFG]
C67  0.1uF  [FP-GRM15-MFG]
C68  0.1uF  [FP-GRM15-MFG]
C69  0.1uF  [FP-GRM15-MFG]
C70  0.1uF  [FP-GRM15-MFG]
R97  RC0402FR-0739RL  [RESC1005X40X25LL05T10]
R98  RC0402FR-0739RL  [RESC1005X40X25LL05T10]
R99  RC0402FR-0739RL  [RESC1005X40X25LL05T10]
R100  RC0402FR-0739RL  [RESC1005X40X25LL05T10]
R101  RC0402FR-0739RL  [RESC1005X40X25LL05T10]
R102  RC0402FR-0747RL  [RESC1005X40X25LL05T10]
R103  RC0402FR-0739RL  [RESC1005X40X25LL05T10]
R104  RC0402FR-0739RL  [RESC1005X40X25LL05T10]
R105  RC0402FR-0739RL  [RESC1005X40X25LL05T10]
R106  RC0402FR-0775RL  [RESC1005X40X25LL05T10]
R107  RC0402FR-0739RL  [RESC1005X40X25LL05T10]
R108  RC0402FR-0739RL  [RESC1005X40X25LL05T10]
R109  RC0402FR-0739RL  [RESC1005X40X25LL05T10]
R110  RC0402FR-0739RL  [RESC1005X40X25LL05T10]
R111  RC0402FR-0739RL  [RESC1005X40X25LL05T10]
R112  RC0402FR-0739RL  [RESC1005X40X25LL05T10]
R113  RC0402FR-0739RL  [RESC1005X40X25LL05T10]
R114  RC0402FR-0739RL  [RESC1005X40X25LL05T10]
R115  RC0402FR-0739RL  [RESC1005X40X25LL05T10]
R116  RC0402FR-0739RL  [RESC1005X40X25LL05T10]
R117  RC0402FR-0739RL  [RESC1005X40X25LL05T10]
R118  RC0402FR-0739RL  [RESC1005X40X25LL05T10]
R119  RC0402FR-0739RL  [RESC1005X40X25LL05T10]
R120  RC0402FR-0739RL  [RESC1005X40X25LL05T10]
R121  RC0402FR-0739RL  [RESC1005X40X25LL05T10]
R122  RC0402FR-0739RL  [RESC1005X40X25LL05T10]
R123  RC0402FR-0739RL  [RESC1005X40X25LL05T10]
R124  RC0402FR-0739RL  [RESC1005X40X25LL05T10]
R125  RC0402FR-0739RL  [RESC1005X40X25LL05T10]
R126  RC0402FR-0739RL  [RESC1005X40X25LL05T10]

### Nets
GND: C50.1 C51.1 C52.1 C53.1 C55.1
VDD: C50.2 C51.2 C52.2 C54.1 C55.2 C56.2 C57.1 C58.1 C59.1 C60.1 C61.1 C62.1 C63.1 C64.1 C65.1 C66.1 C67.1 C68.1 C69.1 C70.1 R102.2
VPP: C53.2
VREFCA: C54.2
VTT: C57.2 C58.2 C59.2 C60.2 C61.2 C62.2 C63.2 C64.2 C65.2 C66.2 C67.2 C68.2 C69.2 C70.2 R97.2 R98.2 R99.2 R100.2 R101.2 R103.2 R104.2 R105.2 R107.2 R108.2 R109.2 R110.2 R111.2 R112.2 R113.2 R114.2 R116.2 R118.2 R119.2 R120.2 R121.2 R122.2 R123.2 R124.2 R125.2 R126.2
A0: R97.1
A1: R100.1
A2: R103.1
A3: R105.1
A4: R108.1
A5: R110.1
A6: R112.1
A7: R114.1
A8: R116.1
A9: R119.1
A10_AP: R121.1
A11: R122.1
A12_BC: R123.1
A13: R124.1
A15_CAS: R111.1
A16_RAS: R113.1
ACT: R125.1
ALERT_n: R102.1
BA0: R118.1
BA1: R120.1
BG0: R99.1
BG1: R98.1
CK0_C: R117.1
CK0_T: R115.1
CK1_C: R106.2
CK1_T: R106.1
CKE: R104.1
CS: R101.1
ODT: R107.1
PAR: R126.1
WE: R109.1
NetC56_1: C56.1 R115.2 R117.2

### Library data of the parts
C50-C52 C55 = CMP-2000-04981-2: Multilayer Ceramic Capacitors 4.7μF ±10% 16V X5R SMD 0603; Tolerance: 10%; Thickness: 0.035inch; Length: 1.6mm; Width: 0.031inch; Height: 0.8mm; Package Quantity: 1; Voltage: 16V; Construction: Flat; Weight: 7.1E-05oz; Depth: 0.8mm; Case Code (Metric): 1608; Series: C; Lead Free: Lead Free; Voltage Rating: 16V; Voltage Rating (DC): 16V; Capacitance: 4.7uF; Termination: SMD/SMT; Dielectric: X5R; REACH SVHC: No SVHC; RoHS Compliant: Yes; Case Code (Imperial): 0603; Case/Package: 0603; Mount: Surface Mount; Dielectric Material: Ceramic; Packaging: Tape and Reel; Min Operating Temperature: -55°C; Max Operating Temperature: 85°C
C53 C54 C57-C70 = CMP-2100-03641-2: as C1 on sheet micron_ram; RoHS: TRUE; Temperature Characteristic: X7R; Octopart: https://octopart.com/grm155r71c104ka88d-murata-196880; Digikey Description: CAP CER 0.1UF 16V X7R 0402; Device Class L3: Ceramic Capacitors; Height: 0.55mm; ComponentLink2Description: Datasheet; Temperature Range Low: -55°C; Ipc Land Pattern Name: CAPC10050X219; ComponentLink2URL: https://search.murata.co.jp/Ceramy/image/img/A01X/G101/ENG/GRM155R71H471KA01-01A.pdf; Device Class L1: Passive Components; Lead Free: yes; Category: Cap; Package: GRM15; Temperature: -55°C to +125°C; Device Class L2: Capacitors; Temperature Range High: +125°C; Mouser Description: 0402 0.1 uF 16V ±10 % Tolerance X7R SMT Multilayer Ceramic Capacitor
C56 = CMP-2008-04637-5: Chip Multilayer Ceramic Capacitors for General Purpose, 0402, 10000pF, X7R, 15%, 10%, 50V; Voltage: 25V; Capacitance: 10nF; Tolerance: 10%; Mount: Surface Mount; Lead Free: Lead Free; Radiation Hardening: No; Case Code (Imperial): 0402; REACH SVHC: No SVHC; Case/Package: 0402; Dielectric: X7R; Voltage Rating (DC): 50V; Max Operating Temperature: 125°C; Termination: SMD/SMT; Material: Ceramic; Width: 0.02inch; Package Quantity: 1; Voltage Rating: 50V; Thickness: 0.022inch; Packaging: Tape and Reel; Height: 0.5mm; Number of Pins: 2; Case Code (Metric): 1005; Min Operating Temperature: -55°C; Length: 1mm; Depth: 0.5mm
R97-R101 R103-R105 R107-R126 = CMP-1011-00350-2: Manufacturer: Yageo / Phycomp; Part Number: RC0402FR-0739RL
R102 = CMP-2002-07703-1: Manufacturer: Yageo / Phycomp; Part Number: RC0402FR-0747RL
R106 = CMP-2002-07798-1: Manufacturer: Yageo / Phycomp; Part Number: RC0402FR-0775RL